# Altium project SMALL_BCMV1.0.PrjPcb (part 1 of 3)
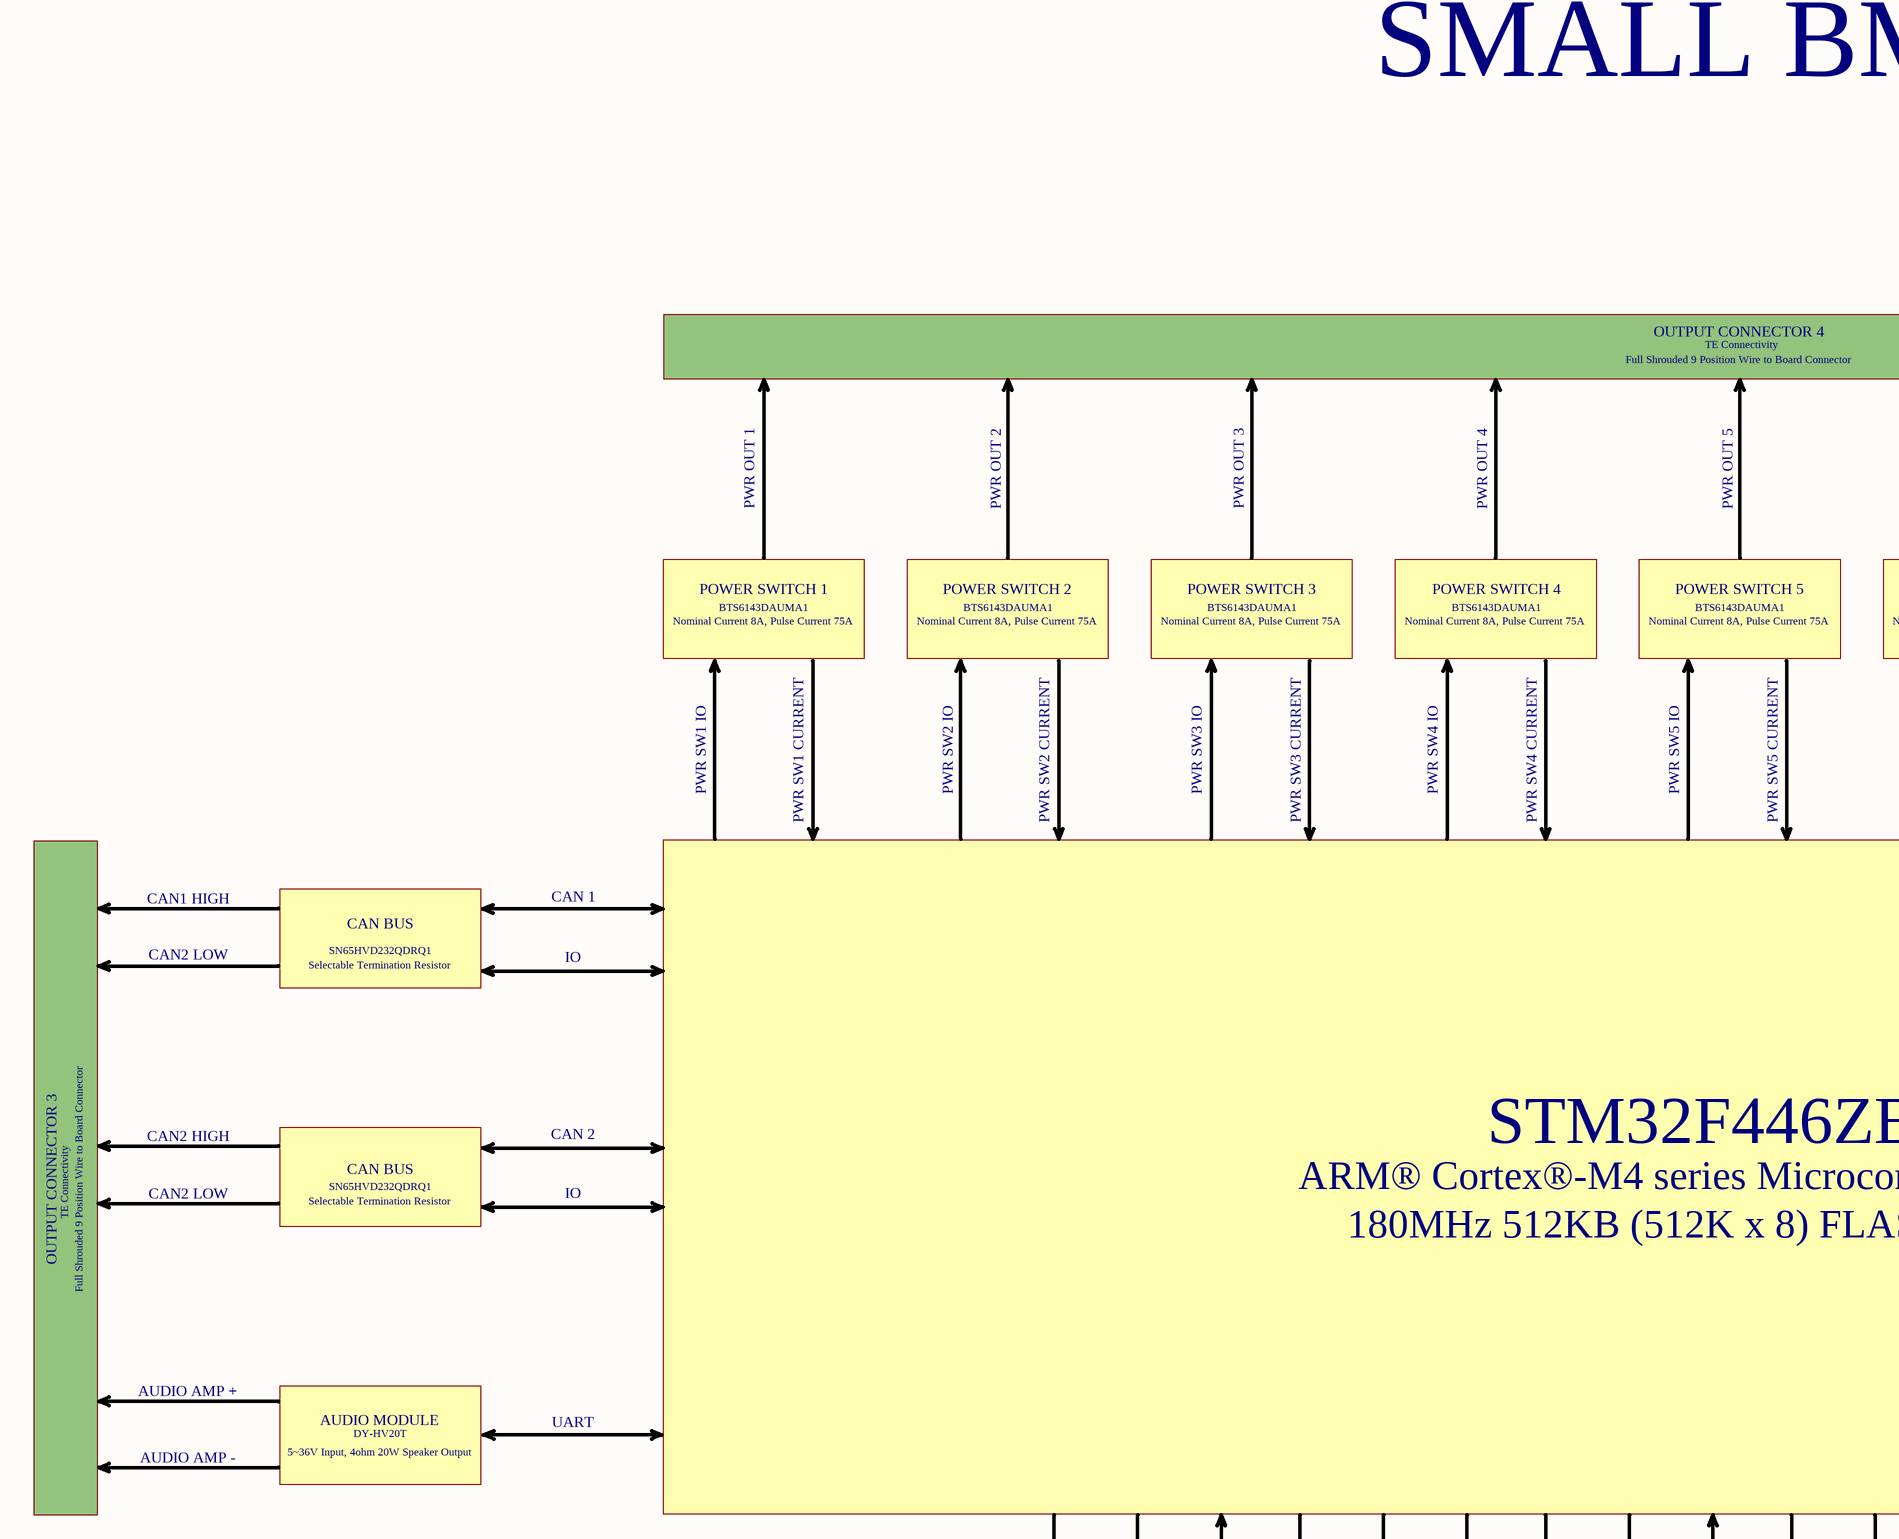
[diagram p0: BCM_Block_diagram.SchDoc, top left]
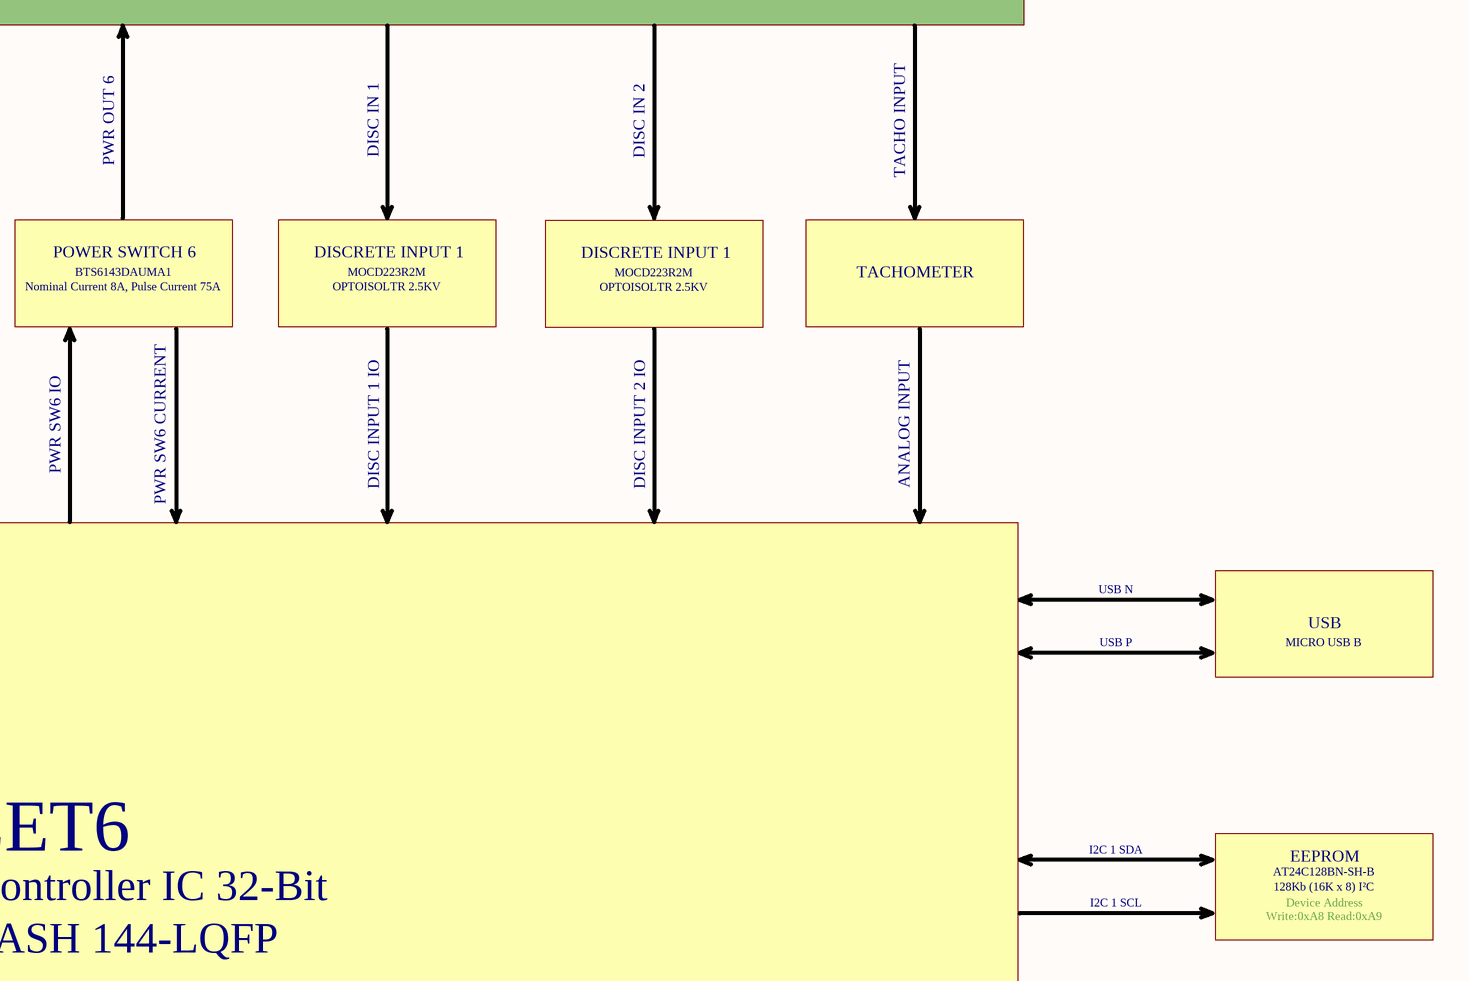
[diagram p1: BCM_Block_diagram.SchDoc, top right]
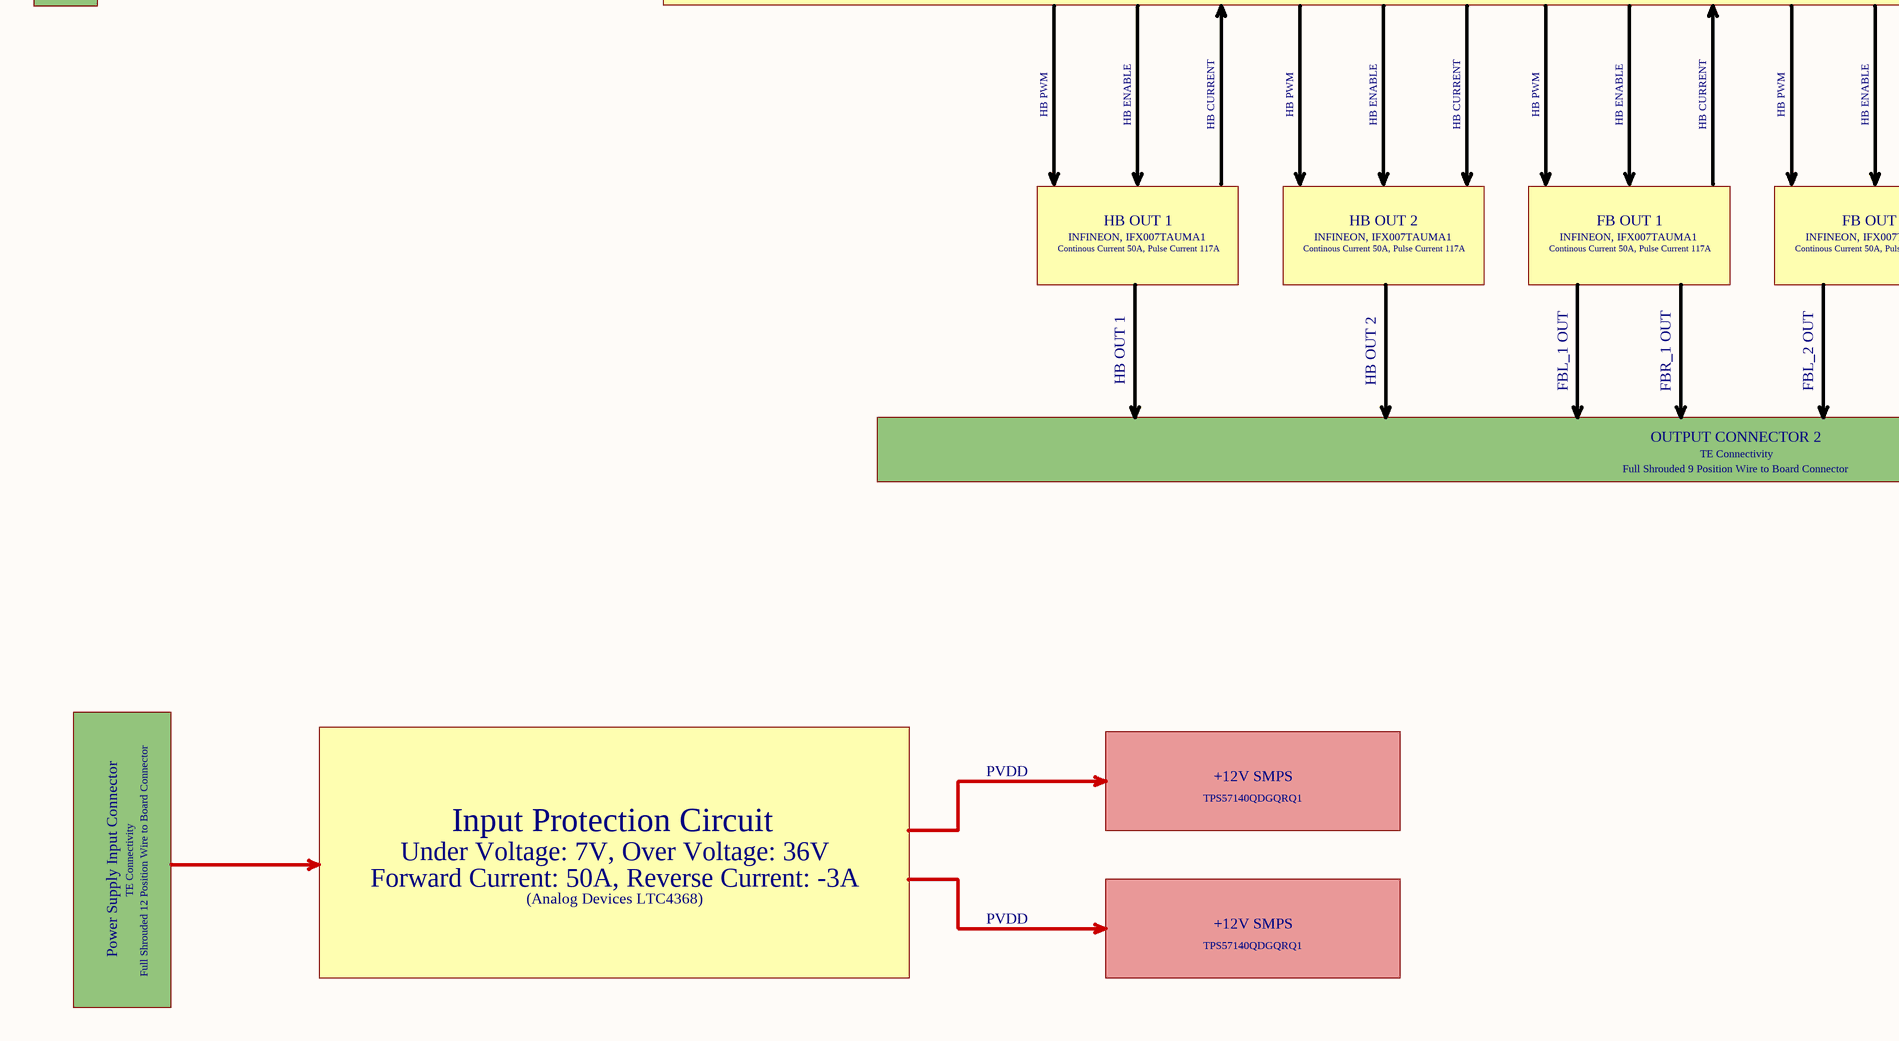
[diagram p2: BCM_Block_diagram.SchDoc, bottom left]
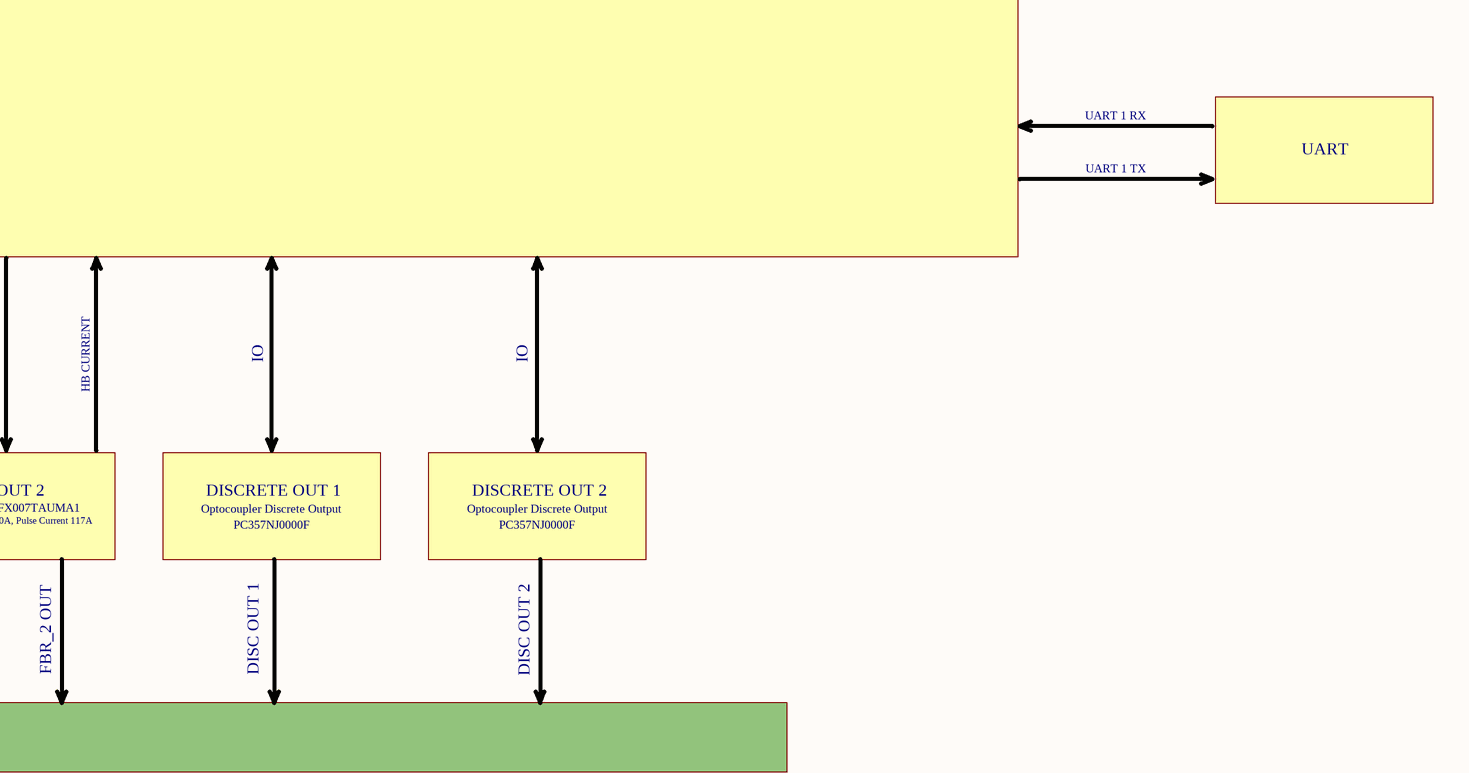
[diagram p3: BCM_Block_diagram.SchDoc, bottom right]
REV: V1.0
13 sheets, 478 parts. Net scope: hierarchical (ports join the sheet entries above them; power ports are global).
Board file: SMALL_BCM.PcbDoc
Sheets:
  BCM_Block_diagram.SchDoc
  SMALL_BCM.SchDoc
    U_F_BRIDGE1 = F_BRIDGE.SchDoc
    U_F_BRIDGE2 = F_BRIDGE.SchDoc
    U_H_BRIDGE1 = H_BRIDGE.SchDoc
    U_H_BRIDGE2 = H_BRIDGE.SchDoc
    U_HS_SW1 = HS_SW.SchDoc
    U_HS_SW2 = HS_SW.SchDoc
    U_HS_SW3 = HS_SW.SchDoc
    U_HS_SW4 = HS_SW.SchDoc
    U_HS_SW5 = HS_SW.SchDoc
    U_HS_SW6 = HS_SW.SchDoc
    U_USB = USB.SchDoc
    U_INPUT_PROTECTION = INPUT_PROTECTION.SchDoc
    U_Voltage_conversion = Voltage_conversion.SchDoc
    U_Controller = Controller.SchDoc
    U_DISCRETE_INPUT = DISCRETE_INPUT.SchDoc
    U_ANALOG_MUX = ANALOG_MUX.SchDoc
    U_DISCRETE_OUT1 = DISCRETE_OUT.SchDoc
    U_DISCRETE_OUT2 = DISCRETE_OUT.SchDoc
    U_CAN = CAN.SchDoc

## Sheet BCM_Block_diagram.SchDoc
size A1; SheetNumber: 1; SheetTotal: 13

### Notes on the sheet
- SMALL BMC V1.0
- OUTPUT CONNECTOR 4
- Full Shrouded 9 Position Wire to Board Connector
- TE Connectivity
- PWR OUT 1
- PWR OUT 2
- PWR OUT 3
- PWR OUT 4
- PWR OUT 5
- PWR OUT 6
- DISC IN 1
- DISC IN 2
- TACHO INPUT
- POWER SWITCH 1
- POWER SWITCH 2
- POWER SWITCH 3
- POWER SWITCH 4
- POWER SWITCH 5
- POWER SWITCH 6
- DISCRETE INPUT 1
- Nominal Current 8A, Pulse Current 75A
- BTS6143DAUMA1
- OPTOISOLTR 2.5KV
- MOCD223R2M
- TACHOMETER
- PWR SW1 IO
- PWR SW1 CURRENT
- PWR SW2 IO
- PWR SW2 CURRENT
- PWR SW3 IO
- PWR SW3 CURRENT
- PWR SW4 IO
- PWR SW4 CURRENT
- PWR SW5 IO
- PWR SW5 CURRENT
- PWR SW6 IO
- PWR SW6 CURRENT
- DISC INPUT 1 IO
- DISC INPUT 2 IO
- ANALOG INPUT
- CAN1 HIGH
- CAN 1
- USB N
- CAN2 LOW
- Selectable Termination Resistor
- SN65HVD232QDRQ1
- CAN BUS
- IO
- USB P
- MICRO USB B
- USB
- CAN2 HIGH
- CAN 2
- STM32F446ZET6
- I2C 1 SDA
- EEPROM
- ARM® Cortex®-M4 series Microcontroller IC 32-Bit
- I2C 1 SCL
- Write:0xA8 Read:0xA9
- AT24C128BN-SH-B
- 128Kb (16K x 8) I²C
- Device Address
- OUTPUT CONNECTOR 3
- 180MHz 512KB (512K x 8) FLASH 144-LQFP
- AUDIO AMP +
- UART 1 RX
- AUDIO AMP -
- 5~36V Input, 4ohm 20W Speaker Output
- AUDIO MODULE
- DY-HV20T
- UART
- UART 1 TX
- HB PWM
- HB ENABLE
- HB CURRENT
- Continous Current 50A, Pulse Current 117A
- INFINEON, IFX007TAUMA1
- HB OUT 1
- HB OUT 2
- FB OUT 1
- FB OUT 2
- Optocoupler Discrete Output
- DISCRETE OUT 1
- PC357NJ0000F
- DISCRETE OUT 2
- FBL_1 OUT
- FBR_1 OUT
- FBL_2 OUT
- FBR_2 OUT
- DISC OUT 1
- DISC OUT 2
- OUTPUT CONNECTOR 2
- PVDD
- TPS57140QDGQRQ1
- +12V SMPS
- Forward Current: 50A, Reverse Current: -3A
- Under Voltage: 7V, Over Voltage: 36V
- Input Protection Circuit
- Power Supply Input Connector
- (Analog Devices LTC4368)
- Full Shrouded 12 Position Wire to Board Connector
- THIS DOCUMENT AND THE DATA DISCLOSED HEREIN OR
- HEREWITH IS THE PROPERTY OF ALTIUM LIMITED AND MAY
- DWG NO:
- REVISION
- REV:
- DESCRIPTION
- DATE
- APPROVED
- BE FREELY DISTRIBUTED IN WHOLE. NO RIGHTS ARE
- RESERVED OR EXPRESS OR IMPLIED WARANTEE GIVEN.
- ENG:
- APPROVALS
- PROJECT
- DSN:
- CHK:
- REFERENCE DOCUMENTS
- PROJECT REVISION:
- TITLE
- DOCUMENT REVISION:
- DESIGN ITEM:
- BOM:
- FAB DWG:
- PCB DWG:
- ASSY DWG:
- SCALE:
- A3
- SIZE
- CAGE CODE
- FILE NAME
- DWG NO.
- SHEET
- OF
- REV

## Sheet SMALL_BCM.SchDoc
size A2; SheetNumber: 2; SheetTotal: 13
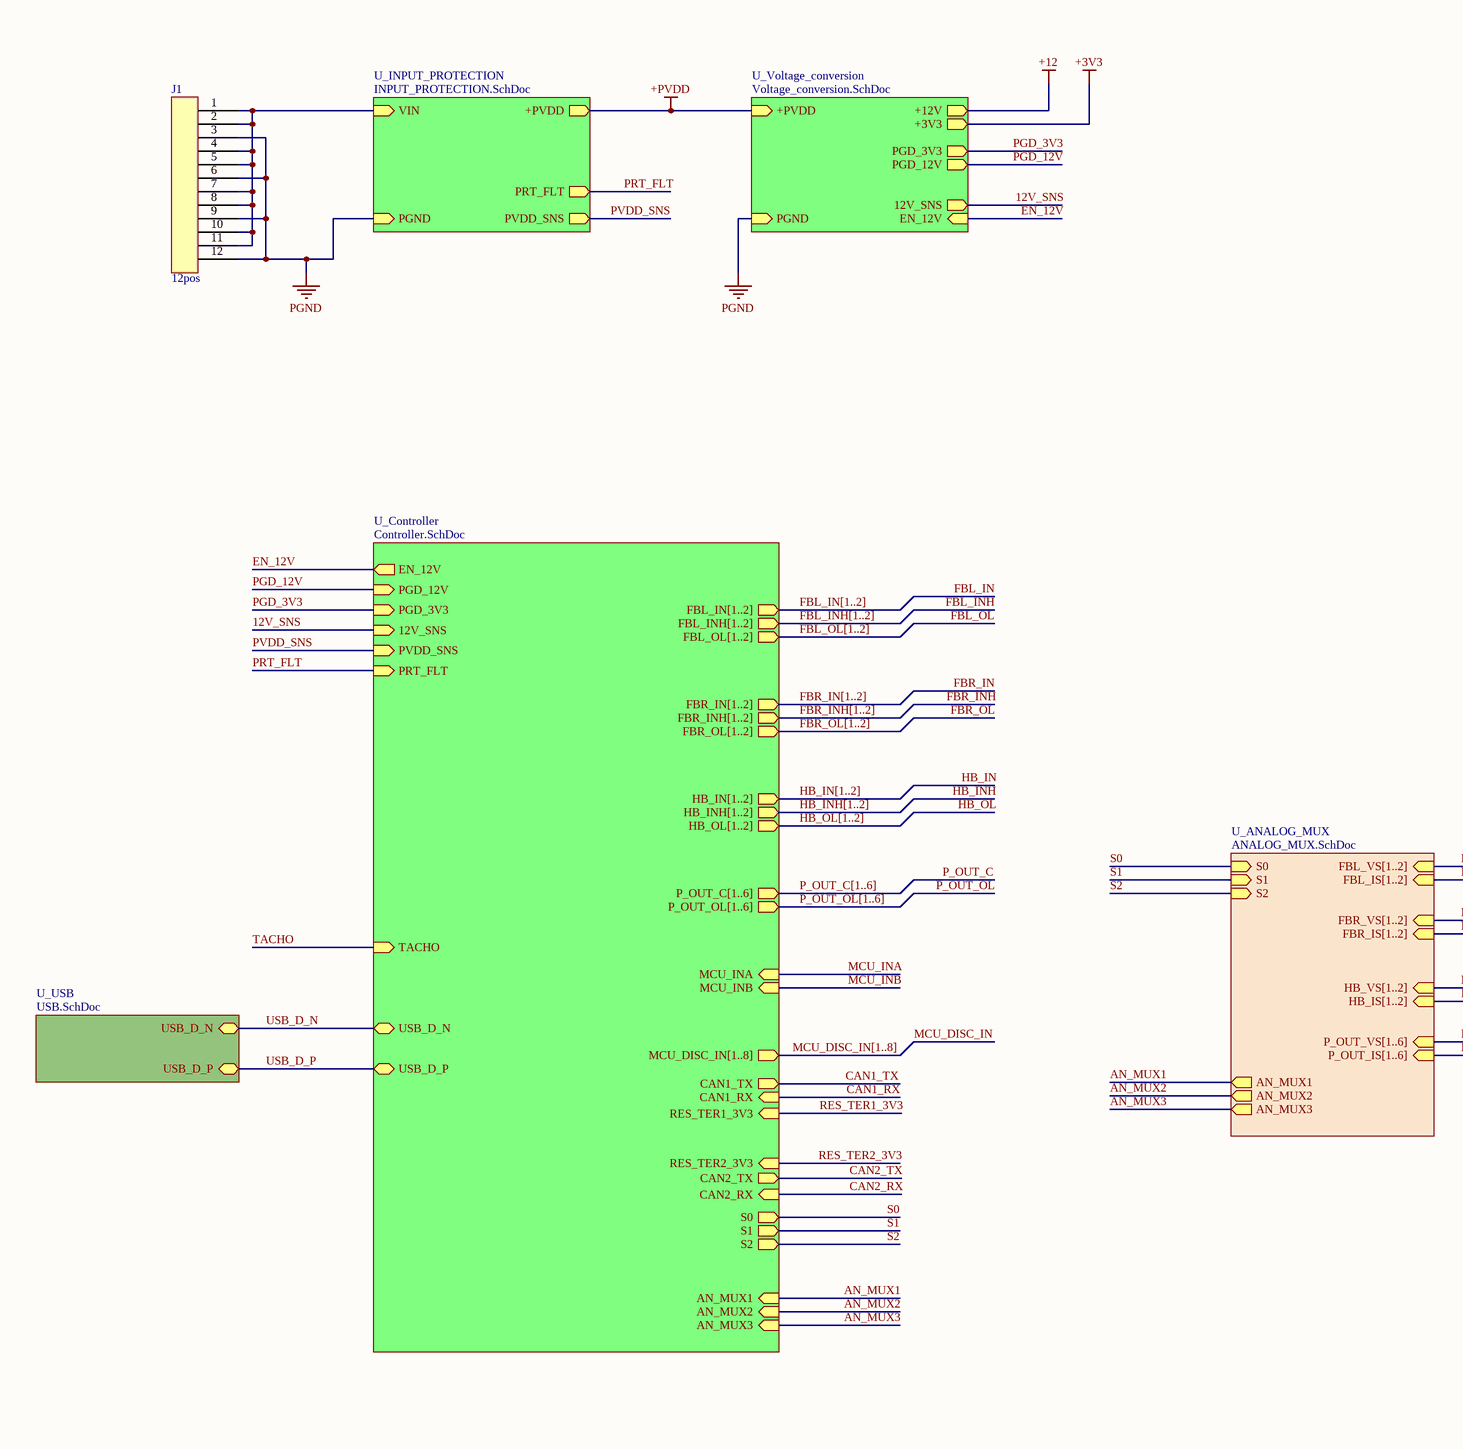
[diagram p4: SMALL_BCM.SchDoc, left]
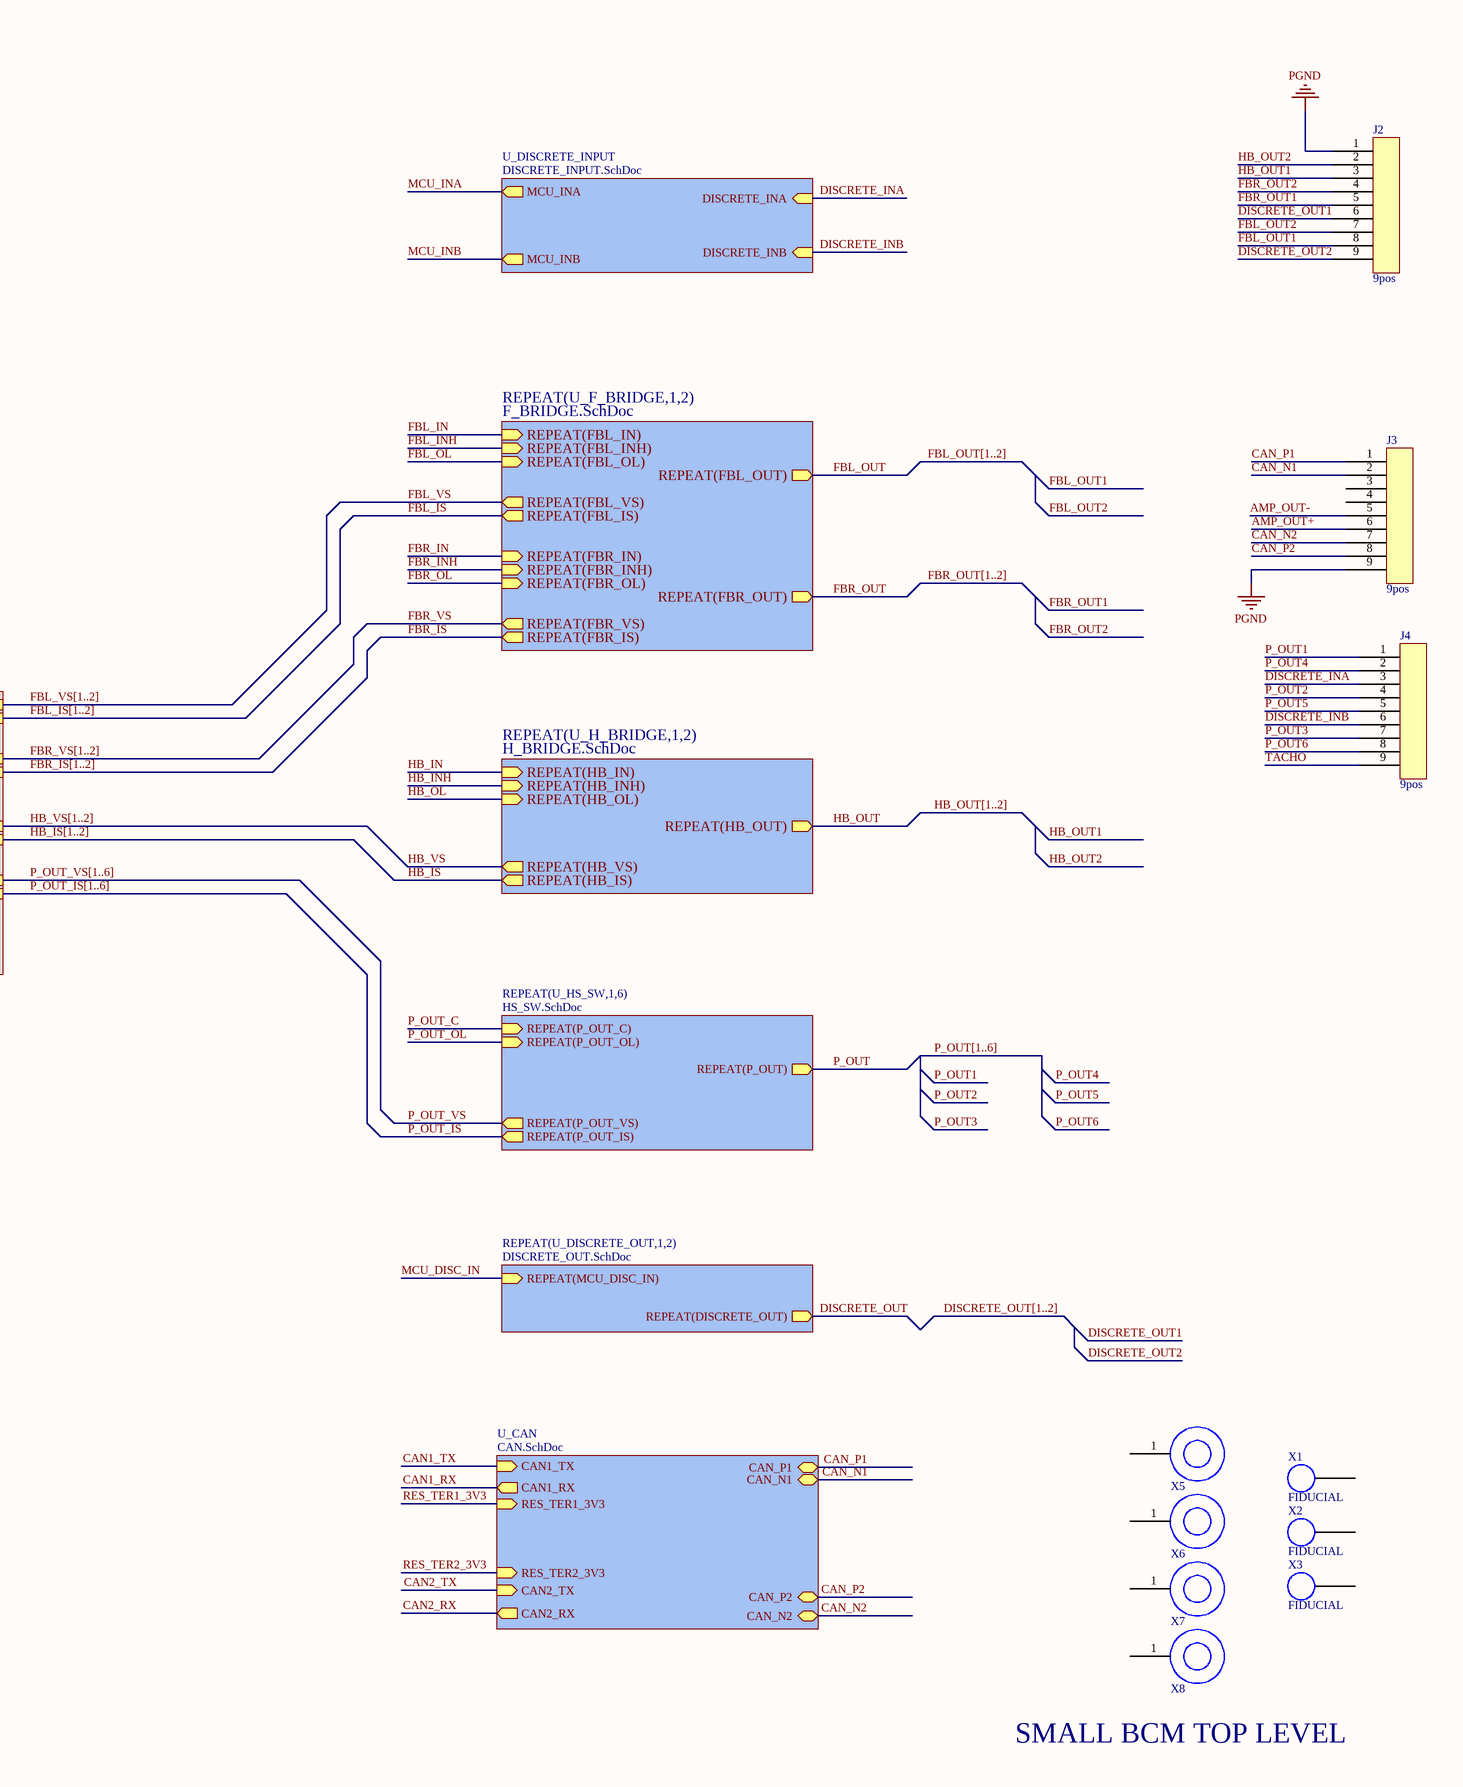
[diagram p5: SMALL_BCM.SchDoc, right]

### Parts
J1  12pos  [9-966140-3]
J2  9pos  [9-966140-4]
J3  9pos  [9-966140-4]
J4  9pos  [9-966140-4]
X1  FIDUCIAL  [FIDUCIAL]  (no BOM)
X2  FIDUCIAL  [FIDUCIAL]  (no BOM)
X3  FIDUCIAL  [FIDUCIAL]  (no BOM)
X5  M3  [FIXING_M3]  (value not drawn)  (no BOM)
X6  M3  [FIXING_M3]  (value not drawn)  (no BOM)
X7  M3  [FIXING_M3]  (value not drawn)  (no BOM)
X8  M3  [FIXING_M3]  (value not drawn)  (no BOM)

### Sub-sheets
REPEAT(U_DISCRETE_OUT,1,2) = DISCRETE_OUT.SchDoc: REPEAT(MCU_DISC_IN) (in), REPEAT(DISCRETE_OUT) (out)
REPEAT(U_F_BRIDGE,1,2) = F_BRIDGE.SchDoc: REPEAT(FBL_IN) (in), REPEAT(FBL_INH) (in), REPEAT(FBL_OL) (in), REPEAT(FBL_OUT) (out), REPEAT(FBL_VS) (out), REPEAT(FBL_IS) (out), REPEAT(FBR_IN) (in), REPEAT(FBR_INH) (in), REPEAT(FBR_OL) (in), REPEAT(FBR_OUT) (out), REPEAT(FBR_VS) (out), REPEAT(FBR_IS) (out)
REPEAT(U_H_BRIDGE,1,2) = H_BRIDGE.SchDoc: REPEAT(HB_IN) (in), REPEAT(HB_INH) (in), REPEAT(HB_IS) (out), REPEAT(HB_OL) (in), REPEAT(HB_OUT) (out), REPEAT(HB_VS) (out)
REPEAT(U_HS_SW,1,6) = HS_SW.SchDoc: REPEAT(P_OUT) (out), REPEAT(P_OUT_VS) (out), REPEAT(P_OUT_IS) (out), REPEAT(P_OUT_OL) (in), REPEAT(P_OUT_C) (in)
U_ANALOG_MUX = ANALOG_MUX.SchDoc: AN_MUX1 (out), AN_MUX2 (out), AN_MUX3 (out), S0 (in), S1 (in), S2 (in), FBR_VS[1..2] (in), FBL_VS[1..2] (in), P_OUT_VS[1..6] (in), P_OUT_IS[1..6] (in), HB_IS[1..2] (in), HB_VS[1..2] (in), FBL_IS[1..2] (in), FBR_IS[1..2] (in)
U_CAN = CAN.SchDoc: CAN_P1 (bidir), CAN_N1 (bidir), CAN1_TX (in), CAN1_RX (out), CAN_P2 (bidir), CAN_N2 (bidir), CAN2_TX (in), CAN2_RX (out), RES_TER1_3V3 (in), RES_TER2_3V3 (in)
U_Controller = Controller.SchDoc: CAN1_RX (in), CAN1_TX (out), USB_D_N (bidir), USB_D_P (bidir), HB_INH[1..2] (out), MCU_DISC_IN[1..8] (out), FBR_OL[1..2] (out), FBL_IN[1..2] (out), HB_IN[1..2] (out), 12V_SNS (in), FBL_INH[1..2] (out), HB_OL[1..2] (out), P_OUT_C[1..6] (out), MCU_INB (in), P_OUT_OL[1..6] (out), PGD_12V (in), FBL_OL[1..2] (out), MCU_INA (in), PGD_3V3 (in), FBR_INH[1..2] (out), EN_12V (out), FBR_IN[1..2] (out), S1 (out), S0 (out), S2 (out), AN_MUX3 (in), AN_MUX2 (in), AN_MUX1 (in), PVDD_SNS (in), PRT_FLT (in), TACHO (in), CAN2_RX (in), CAN2_TX (out), RES_TER2_3V3 (in), RES_TER1_3V3 (in)
U_DISCRETE_INPUT = DISCRETE_INPUT.SchDoc: MCU_INB (out), MCU_INA (out), DISCRETE_INA (in), DISCRETE_INB (in)
U_INPUT_PROTECTION = INPUT_PROTECTION.SchDoc: VIN (in), PGND (in), +PVDD (out), PRT_FLT (out), PVDD_SNS (out)
U_USB = USB.SchDoc: USB_D_N (bidir), USB_D_P (bidir)
U_Voltage_conversion = Voltage_conversion.SchDoc: +PVDD (in), PGND (in), +12V (out), PGD_12V (out), +3V3 (out), PGD_3V3 (out), 12V_SNS (out), EN_12V (in)

### Nets
+PVDD: sheet U_INPUT_PROTECTION/+PVDD, sheet U_Voltage_conversion/+PVDD
PGND: J1.3 J1.6 J1.9 J1.12 J2.1 J3.9 ; sheet U_INPUT_PROTECTION/PGND, sheet U_Voltage_conversion/PGND
VIN: J1.1 J1.2 J1.4 J1.5 J1.7 J1.8 J1.10 J1.11 ; sheet U_INPUT_PROTECTION/VIN
12V_SNS: sheet U_Voltage_conversion/12V_SNS, sheet U_Controller/12V_SNS
AMP_OUT+: J3.6
AMP_OUT-: J3.5
AN_MUX1: sheet U_Controller/AN_MUX1, sheet U_ANALOG_MUX/AN_MUX1
AN_MUX2: sheet U_Controller/AN_MUX2, sheet U_ANALOG_MUX/AN_MUX2
AN_MUX3: sheet U_Controller/AN_MUX3, sheet U_ANALOG_MUX/AN_MUX3
CAN1_RX: sheet U_Controller/CAN1_RX, sheet U_CAN/CAN1_RX
CAN1_TX: sheet U_Controller/CAN1_TX, sheet U_CAN/CAN1_TX
CAN2_RX: sheet U_Controller/CAN2_RX, sheet U_CAN/CAN2_RX
CAN2_TX: sheet U_Controller/CAN2_TX, sheet U_CAN/CAN2_TX
CAN_N1: J3.2 ; sheet U_CAN/CAN_N1  [project net CAN1_N]
CAN_N2: J3.7 ; sheet U_CAN/CAN_N2  [project net CAN2_N]
CAN_P1: J3.1 ; sheet U_CAN/CAN_P1  [project net CAN1_P]
CAN_P2: J3.8 ; sheet U_CAN/CAN_P2  [project net CAN2_P]
DISCRETE_INA: J4.3 ; sheet U_DISCRETE_INPUT/DISCRETE_INA
DISCRETE_INB: J4.6 ; sheet U_DISCRETE_INPUT/DISCRETE_INB
DISCRETE_OUT: sheet REPEAT(U_DISCRETE_OUT,1,2)/REPEAT(DISCRETE_OUT)
DISCRETE_OUT1: J2.6  [project net DISCRETE_OUT]
DISCRETE_OUT2: J2.9  [project net DISCRETE_OUT]
EN_12V: sheet U_Voltage_conversion/EN_12V, sheet U_Controller/EN_12V
FBL_IN: sheet REPEAT(U_F_BRIDGE,1,2)/REPEAT(FBL_IN)
FBL_INH: sheet REPEAT(U_F_BRIDGE,1,2)/REPEAT(FBL_INH)
FBL_IS: sheet REPEAT(U_F_BRIDGE,1,2)/REPEAT(FBL_IS)
FBL_OL: sheet REPEAT(U_F_BRIDGE,1,2)/REPEAT(FBL_OL)
FBL_OUT: sheet REPEAT(U_F_BRIDGE,1,2)/REPEAT(FBL_OUT)
FBL_OUT1: J2.8
FBL_OUT2: J2.7
FBL_VS: sheet REPEAT(U_F_BRIDGE,1,2)/REPEAT(FBL_VS)
FBR_IN: sheet REPEAT(U_F_BRIDGE,1,2)/REPEAT(FBR_IN)
FBR_INH: sheet REPEAT(U_F_BRIDGE,1,2)/REPEAT(FBR_INH)
FBR_IS: sheet REPEAT(U_F_BRIDGE,1,2)/REPEAT(FBR_IS)
FBR_OL: sheet REPEAT(U_F_BRIDGE,1,2)/REPEAT(FBR_OL)
FBR_OUT: sheet REPEAT(U_F_BRIDGE,1,2)/REPEAT(FBR_OUT)
FBR_OUT1: J2.5
FBR_OUT2: J2.4
FBR_VS: sheet REPEAT(U_F_BRIDGE,1,2)/REPEAT(FBR_VS)
HB_IN: sheet REPEAT(U_H_BRIDGE,1,2)/REPEAT(HB_IN)
HB_INH: sheet REPEAT(U_H_BRIDGE,1,2)/REPEAT(HB_INH)
HB_IS: sheet REPEAT(U_H_BRIDGE,1,2)/REPEAT(HB_IS)
HB_OL: sheet REPEAT(U_H_BRIDGE,1,2)/REPEAT(HB_OL)
HB_OUT: sheet REPEAT(U_H_BRIDGE,1,2)/REPEAT(HB_OUT)
HB_OUT1: J2.3
HB_OUT2: J2.2
HB_VS: sheet REPEAT(U_H_BRIDGE,1,2)/REPEAT(HB_VS)
MCU_DISC_IN: sheet REPEAT(U_DISCRETE_OUT,1,2)/REPEAT(MCU_DISC_IN)
MCU_INA: sheet U_Controller/MCU_INA, sheet U_DISCRETE_INPUT/MCU_INA
MCU_INB: sheet U_Controller/MCU_INB, sheet U_DISCRETE_INPUT/MCU_INB
P_OUT: sheet REPEAT(U_HS_SW,1,6)/REPEAT(P_OUT)
P_OUT1: J4.1
P_OUT2: J4.4
P_OUT3: J4.7
P_OUT4: J4.2
P_OUT5: J4.5
P_OUT6: J4.8
P_OUT_C: sheet REPEAT(U_HS_SW,1,6)/REPEAT(P_OUT_C)
P_OUT_IS: sheet REPEAT(U_HS_SW,1,6)/REPEAT(P_OUT_IS)
P_OUT_OL: sheet REPEAT(U_HS_SW,1,6)/REPEAT(P_OUT_OL)
P_OUT_VS: sheet REPEAT(U_HS_SW,1,6)/REPEAT(P_OUT_VS)
PGD_3V3: sheet U_Voltage_conversion/PGD_3V3, sheet U_Controller/PGD_3V3
PGD_12V: sheet U_Voltage_conversion/PGD_12V, sheet U_Controller/PGD_12V  [project net PDG_12V]
PRT_FLT: sheet U_INPUT_PROTECTION/PRT_FLT, sheet U_Controller/PRT_FLT
PVDD_SNS: sheet U_INPUT_PROTECTION/PVDD_SNS, sheet U_Controller/PVDD_SNS
RES_TER1_3V3: sheet U_Controller/RES_TER1_3V3, sheet U_CAN/RES_TER1_3V3
RES_TER2_3V3: sheet U_Controller/RES_TER2_3V3, sheet U_CAN/RES_TER2_3V3
S0: sheet U_Controller/S0, sheet U_ANALOG_MUX/S0
S1: sheet U_Controller/S1, sheet U_ANALOG_MUX/S1
S2: sheet U_Controller/S2, sheet U_ANALOG_MUX/S2
TACHO: J4.9 ; sheet U_Controller/TACHO
USB_D_N: sheet U_USB/USB_D_N, sheet U_Controller/USB_D_N
USB_D_P: sheet U_USB/USB_D_P, sheet U_Controller/USB_D_P

Not connected (* = marked no-connect by the designer): J3 3 4; X1 1; X2 1; X3 1; X5 1; X6 1; X7 1; X8 1

### Buses and harness runs
bus DISCRETE_OUT[1..2]
bus FBL_IN[1..2] = sheet U_Controller/FBL_IN[1..2]
bus FBL_INH[1..2] = sheet U_Controller/FBL_INH[1..2]
bus FBL_IS[1..2] = sheet U_ANALOG_MUX/FBL_IS[1..2]
bus FBL_OL[1..2] = sheet U_Controller/FBL_OL[1..2]
bus FBL_OUT[1..2]
bus FBL_VS[1..2] = sheet U_ANALOG_MUX/FBL_VS[1..2]
bus FBR_IN[1..2] = sheet U_Controller/FBR_IN[1..2]
bus FBR_INH[1..2] = sheet U_Controller/FBR_INH[1..2]
bus FBR_IS[1..2] = sheet U_ANALOG_MUX/FBR_IS[1..2]
bus FBR_OL[1..2] = sheet U_Controller/FBR_OL[1..2]
bus FBR_OUT[1..2]
bus FBR_VS[1..2] = sheet U_ANALOG_MUX/FBR_VS[1..2]
bus HB_IN[1..2] = sheet U_Controller/HB_IN[1..2]
bus HB_INH[1..2] = sheet U_Controller/HB_INH[1..2]
bus HB_IS[1..2] = sheet U_ANALOG_MUX/HB_IS[1..2]
bus HB_OL[1..2] = sheet U_Controller/HB_OL[1..2]
bus HB_OUT[1..2]
bus HB_VS[1..2] = sheet U_ANALOG_MUX/HB_VS[1..2]
bus MCU_DISC_IN[1..8] = sheet U_Controller/MCU_DISC_IN[1..8]
bus P_OUT[1..6]
bus P_OUT_C[1..6] = sheet U_Controller/P_OUT_C[1..6]
bus P_OUT_IS[1..6] = sheet U_ANALOG_MUX/P_OUT_IS[1..6]
bus P_OUT_OL[1..6] = sheet U_Controller/P_OUT_OL[1..6]
bus P_OUT_VS[1..6] = sheet U_ANALOG_MUX/P_OUT_VS[1..6]

### Notes on the sheet
- SMALL BCM TOP LEVEL

### Library data of the parts
J1 = 3x4_9-966140-3: CONN HEADER R/A 12POS 5MM; Order Code: DIGI : A126711-ND; P/N: 9-966140-3; Value: 12pos
J2-J4 = 3x4_9-966140-4: CONN HEADER R/A 9POS 5MM; Order Code: DIGI : A122202-ND; P/N: 9-966140-4; Value: 9pos
X1-X3 = FIDUCIAL: FIDUCIAL 1mm
X5-X8 = FIXING_M3: FIXING HOLE M3; Value: M3

## Sheet F_BRIDGE.SchDoc
size A4; SheetNumber: 5; SheetTotal: 13
Used 2 times, as channels U_F_BRIDGE1, U_F_BRIDGE2. Parts and nets are listed once, with the designators drawn on the sheet.
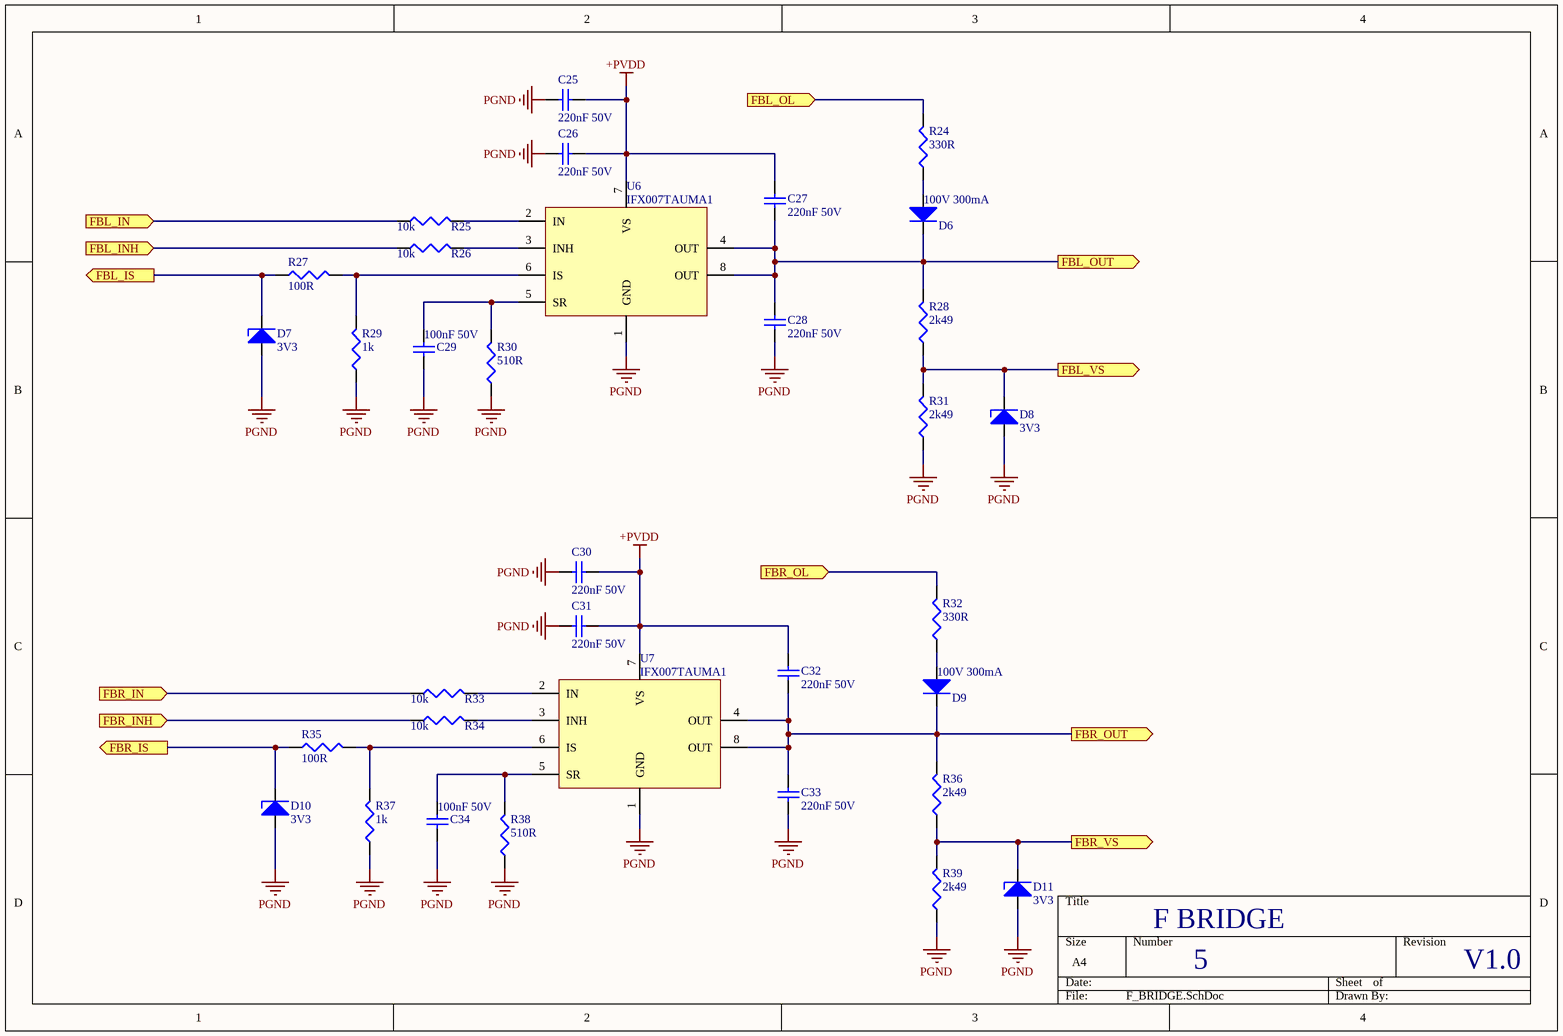
[diagram p6: F_BRIDGE.SchDoc]

### Parts
C25  220nF 50V  [CAP1206]
C26  220nF 50V  [CAP1206]
C27  220nF 50V  [CAP1206]
C28  220nF 50V  [CAP1206]
C29  100nF 50V  [CAP0603]
C30  220nF 50V  [CAP1206]
C31  220nF 50V  [CAP1206]
C32  220nF 50V  [CAP1206]
C33  220nF 50V  [CAP1206]
C34  100nF 50V  [CAP0603]
D6  100V 300mA  [SOD123_1N4148W-7-F]
D7  3V3  [SOD323]
D8  3V3  [SOD323]
D9  100V 300mA  [SOD123_1N4148W-7-F]
D10  3V3  [SOD323]
D11  3V3  [SOD323]
R24  330R  [RES0603]
R25  10k  [RES0603]
R26  10k  [RES0603]
R27  100R  [RES0603]
R28  2k49  [RES0603]
R29  1k  [RES0603]
R30  510R  [RES0603]
R31  2k49  [RES0603]
R32  330R  [RES0603]
R33  10k  [RES0603]
R34  10k  [RES0603]
R35  100R  [RES0603]
R36  2k49  [RES0603]
R37  1k  [RES0603]
R38  510R  [RES0603]
R39  2k49  [RES0603]
U6  P/N: IFX007TAUMA1  [TO-263-8]  (hidden comment: 55A)
U7  P/N: IFX007TAUMA1  [TO-263-8]  (hidden comment: 55A)

### Ports
FBL_IN (in), FBL_INH (in), FBL_IS (out), FBL_OL (in), FBL_OUT (out), FBL_VS (out), FBR_IN (in), FBR_INH (in), FBR_IS (out), FBR_OL (in), FBR_OUT (out), FBR_VS (out)

### Nets
+PVDD: C25.2 C26.2 C27.1 C30.2 C31.2 C32.1 U6.7(VS) U7.7(VS)
PGND: C25.1 C26.1 C28.2 C29.1 C30.1 C31.1 C33.2 C34.1 D7.2(A) D8.2(A) D10.2(A) D11.2(A) R29.1 R30.1 R31.1 R37.1 R38.1 R39.1 U6.1(GND) U7.1(GND)
FBL_IN: R25.1 ; port FBL_IN
FBL_INH: R26.1 ; port FBL_INH
FBL_IS: D7.1(K) R27.1 ; port FBL_IS
FBL_OL: R24.2 ; port FBL_OL
FBL_OUT: C27.2 C28.1 D6.2(K) R28.2 U6.4(OUT) U6.8(OUT) ; port FBL_OUT
FBL_VS: D8.1(K) R28.1 R31.2 ; port FBL_VS
FBR_IN: R33.1 ; port FBR_IN
FBR_INH: R34.1 ; port FBR_INH
FBR_IS: D10.1(K) R35.1 ; port FBR_IS
FBR_OL: R32.2 ; port FBR_OL
FBR_OUT: C32.2 C33.1 D9.2(K) R36.2 U7.4(OUT) U7.8(OUT) ; port FBR_OUT
FBR_VS: D11.1(K) R36.1 R39.2 ; port FBR_VS
NetC29_2: C29.2 R30.2 U6.5(SR)
NetC34_2: C34.2 R38.2 U7.5(SR)
NetD6_1: D6.1(A) R24.1
NetD9_1: D9.1(A) R32.1
NetR25_2: R25.2 U6.2(IN)
NetR26_2: R26.2 U6.3(INH)
NetR27_2: R27.2 R29.2 U6.6(IS)
NetR33_2: R33.2 U7.2(IN)
NetR34_2: R34.2 U7.3(INH)
NetR35_2: R35.2 R37.2 U7.6(IS)

### Channels
U_F_BRIDGE1: designators end in A; ports FBL_IN=FBL_IN1 FBL_INH=FBL_INH1 FBL_IS=FBL_IS1 FBL_OL=FBL_OL1 FBL_OUT=FBL_OUT1 FBL_VS=FBL_VS1 FBR_IN=FBR_IN1 FBR_INH=FBR_INH1 FBR_IS=FBR_IS1 FBR_OL=FBR_OL1 FBR_OUT=FBR_OUT1 FBR_VS=FBR_VS1
U_F_BRIDGE2: designators end in B; ports FBL_IN=FBL_IN2 FBL_INH=FBL_INH2 FBL_IS=FBL_IS2 FBL_OL=FBL_OL2 FBL_OUT=FBL_OUT2 FBL_VS=FBL_VS2 FBR_IN=FBR_IN2 FBR_INH=FBR_INH2 FBR_IS=FBR_IS2 FBR_OL=FBR_OL2 FBR_OUT=FBR_OUT2 FBR_VS=FBR_VS2

### Notes on the sheet
- F BRIDGE

### Library data of the parts
C25-C28 C30-C33 = CAP1206_220nF: CAP CER 0.22UF 50V X7R 1206; P/N: CL31B224KBFNNNE; Order Code: DIGI : CL31B224KBFNNNE; Value: 220nF
C29 C34 = CAP0603_100nF: CAP CER 0.1UF 50V X7R 0603; P/N: C0603C104K5RACTU; Order Code: DIGI : 399-5089-1-ND; Value: 100nF 50V
D6 D9 = DIODE_1N4148W-7-F: DIODE GEN PURP 100V 300MA SOD123; Order Code: DIGI : 1N4148W-FDICT-ND; P/N: 1N4148W-7-F; Value: 100V 300mA
D7 D8 D10 D11 = ZENER_3V3_MM3Z3V3T1G: DIODE ZENER 3.3V 300MW SOD323; Order Code: DIGI : MM3Z3V3T1GOSCT-ND; P/N: MM3Z3V3T1G; Value: 3V3
R24 R32 = RES0603_330R: RES 330 OHM 1% 1/10W 0603; Order Code: DIGI : RMCF0603FT330RCT-ND; P/N: RMCF0603FT330R; ART Code: ART0021648; Value: 330R
R25 R26 R33 R34 = RES0603_10k: RES SMD 10K OHM 5% 1/10W 0603; Order Code: DIGI : 311-10KGRCT-ND; P/N: RC0603JR-0710KL; ART Code: ART0020747; Value: 10k
R27 R35 = RES0603_100R: RES SMD 100R OHM 1% 1/10W 0603; Order Code: DIGI : RMCF0603FT100RCT-ND; P/N: RMCF0603FT100R; ART Code: ART0022201; Value: 100R
R28 R31 R36 R39 = RES0603_2k49: RES 2.49K OHM 1% 1/10W 0603; Order Code: DIGI : RMCF0603FT2K49CT-ND; P/N: RMCF0603FT2K49; ART Code: ART0014241; Value: 2k49
R29 R37 = RES0603_1k: RES SMD 1K OHM 1% 1/10W 0603; Order Code: DIGI : 311-1.00KHRCT-ND; P/N: RC0603FR-071KL; ART Code: ART0014240; Value: 1k
R30 R38 = RES0603_510R: RES 510R OHM 1% 1/10W 0603; Order Code: DIGI : RMCF0603FT510RCT-ND; P/N: RMCF0603FT510R; Value: 510R
U6 U7 = HB_IFX007TAUMA1: IC HALF-BRIDGE DRVR 2 CH TO263; Order Code: DIGI : IFX007TAUMA1CT-ND; Value: 55A

## Sheet H_BRIDGE.SchDoc
size A4; SheetNumber: 6; SheetTotal: 13
Used 2 times, as channels U_H_BRIDGE1, U_H_BRIDGE2. Parts and nets are listed once, with the designators drawn on the sheet.
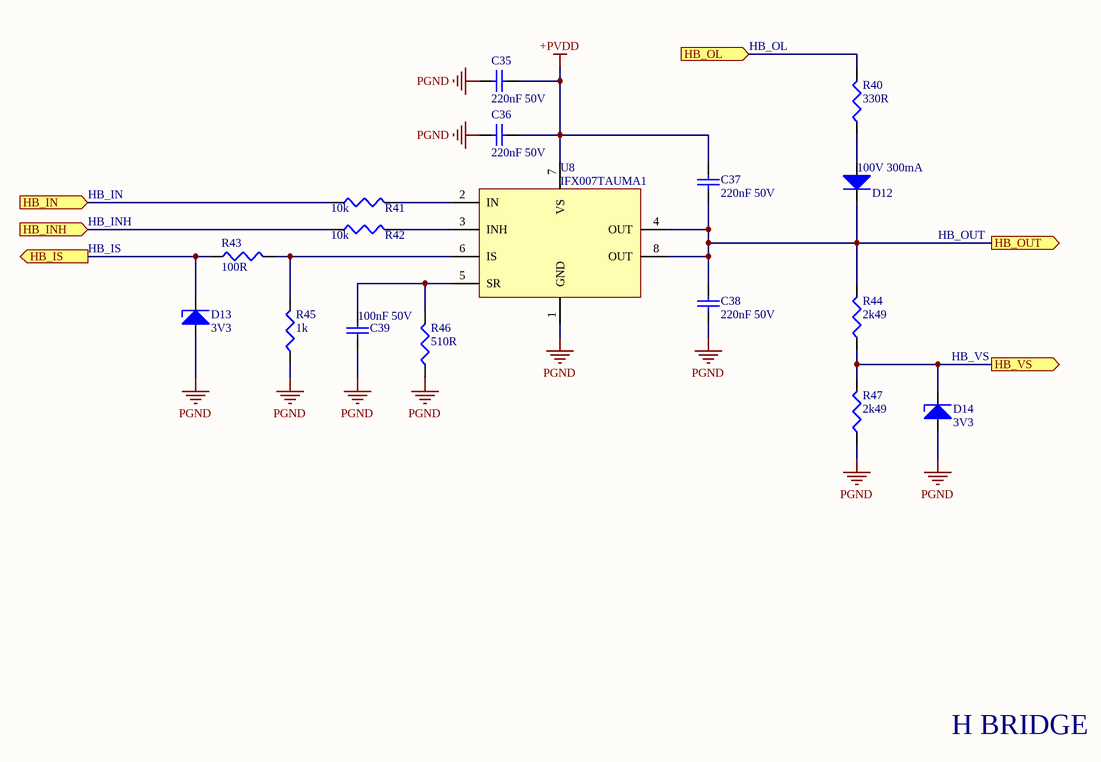
[diagram p7: H_BRIDGE.SchDoc]

### Parts
C35  220nF 50V  [CAP1206]
C36  220nF 50V  [CAP1206]
C37  220nF 50V  [CAP1206]
C38  220nF 50V  [CAP1206]
C39  100nF 50V  [CAP0603]
D12  100V 300mA  [SOD123_1N4148W-7-F]
D13  3V3  [SOD323]
D14  3V3  [SOD323]
R40  330R  [RES0603]
R41  10k  [RES0603]
R42  10k  [RES0603]
R43  100R  [RES0603]
R44  2k49  [RES0603]
R45  1k  [RES0603]
R46  510R  [RES0603]
R47  2k49  [RES0603]
U8  P/N: IFX007TAUMA1  [TO-263-8]  (hidden comment: 55A)

### Ports
HB_IN (in), HB_INH (in), HB_IS (out), HB_OL (in), HB_OUT (out), HB_VS (out)

### Nets
+PVDD: C35.2 C36.2 C37.1 U8.7(VS)
PGND: C35.1 C36.1 C38.2 C39.1 D13.2(A) D14.2(A) R45.1 R46.1 R47.1 U8.1(GND)
HB_IN: R41.1 ; port HB_IN
HB_INH: R42.1 ; port HB_INH
HB_IS: D13.1(K) R43.1 ; port HB_IS
HB_OL: R40.2 ; port HB_OL
HB_OUT: C37.2 C38.1 D12.2(K) R44.2 U8.4(OUT) U8.8(OUT) ; port HB_OUT
HB_VS: D14.1(K) R44.1 R47.2 ; port HB_VS
NetC39_2: C39.2 R46.2 U8.5(SR)
NetD12_1: D12.1(A) R40.1
NetR41_2: R41.2 U8.2(IN)
NetR42_2: R42.2 U8.3(INH)
NetR43_2: R43.2 R45.2 U8.6(IS)

### Channels
U_H_BRIDGE1: designators end in A; ports HB_IN=HB_IN1 HB_INH=HB_INH1 HB_IS=HB_IS1 HB_OL=HB_OL1 HB_OUT=HB_OUT1 HB_VS=HB_VS1
U_H_BRIDGE2: designators end in B; ports HB_IN=HB_IN2 HB_INH=HB_INH2 HB_IS=HB_IS2 HB_OL=HB_OL2 HB_OUT=HB_OUT2 HB_VS=HB_VS2

### Notes on the sheet
- HB_OL
- HB_IN
- HB_INH
- HB_IS
- HB_OUT
- (near D14) HB_VS
- H BRIDGE

### Library data of the parts
C35-C38 = CAP1206_220nF: as C25 on sheet F_BRIDGE; Value: 220nF
C39 = CAP0603_100nF: as C29 on sheet F_BRIDGE; Value: 100nF 50V
D12 = DIODE_1N4148W-7-F: as D6 on sheet F_BRIDGE; P/N: 1N4148W-7-F; Value: 100V 300mA
D13 D14 = ZENER_3V3_MM3Z3V3T1G: as D7 on sheet F_BRIDGE; P/N: MM3Z3V3T1G; Value: 3V3
R40 = RES0603_330R: as R24 on sheet F_BRIDGE; Value: 330R
R41 R42 = RES0603_10k: as R25 on sheet F_BRIDGE; Value: 10k
R43 = RES0603_100R: as R27 on sheet F_BRIDGE; Value: 100R
R44 R47 = RES0603_2k49: as R28 on sheet F_BRIDGE; Value: 2k49
R45 = RES0603_1k: as R29 on sheet F_BRIDGE; Value: 1k
R46 = RES0603_510R: as R30 on sheet F_BRIDGE; Value: 510R
U8 = HB_IFX007TAUMA1: as U6 on sheet F_BRIDGE; Value: 55A

## Sheet HS_SW.SchDoc
size A4; SheetNumber: 7; SheetTotal: 13
Used 6 times, as channels U_HS_SW1, U_HS_SW2, U_HS_SW3, U_HS_SW4, U_HS_SW5, U_HS_SW6. Parts and nets are listed once, with the designators drawn on the sheet.
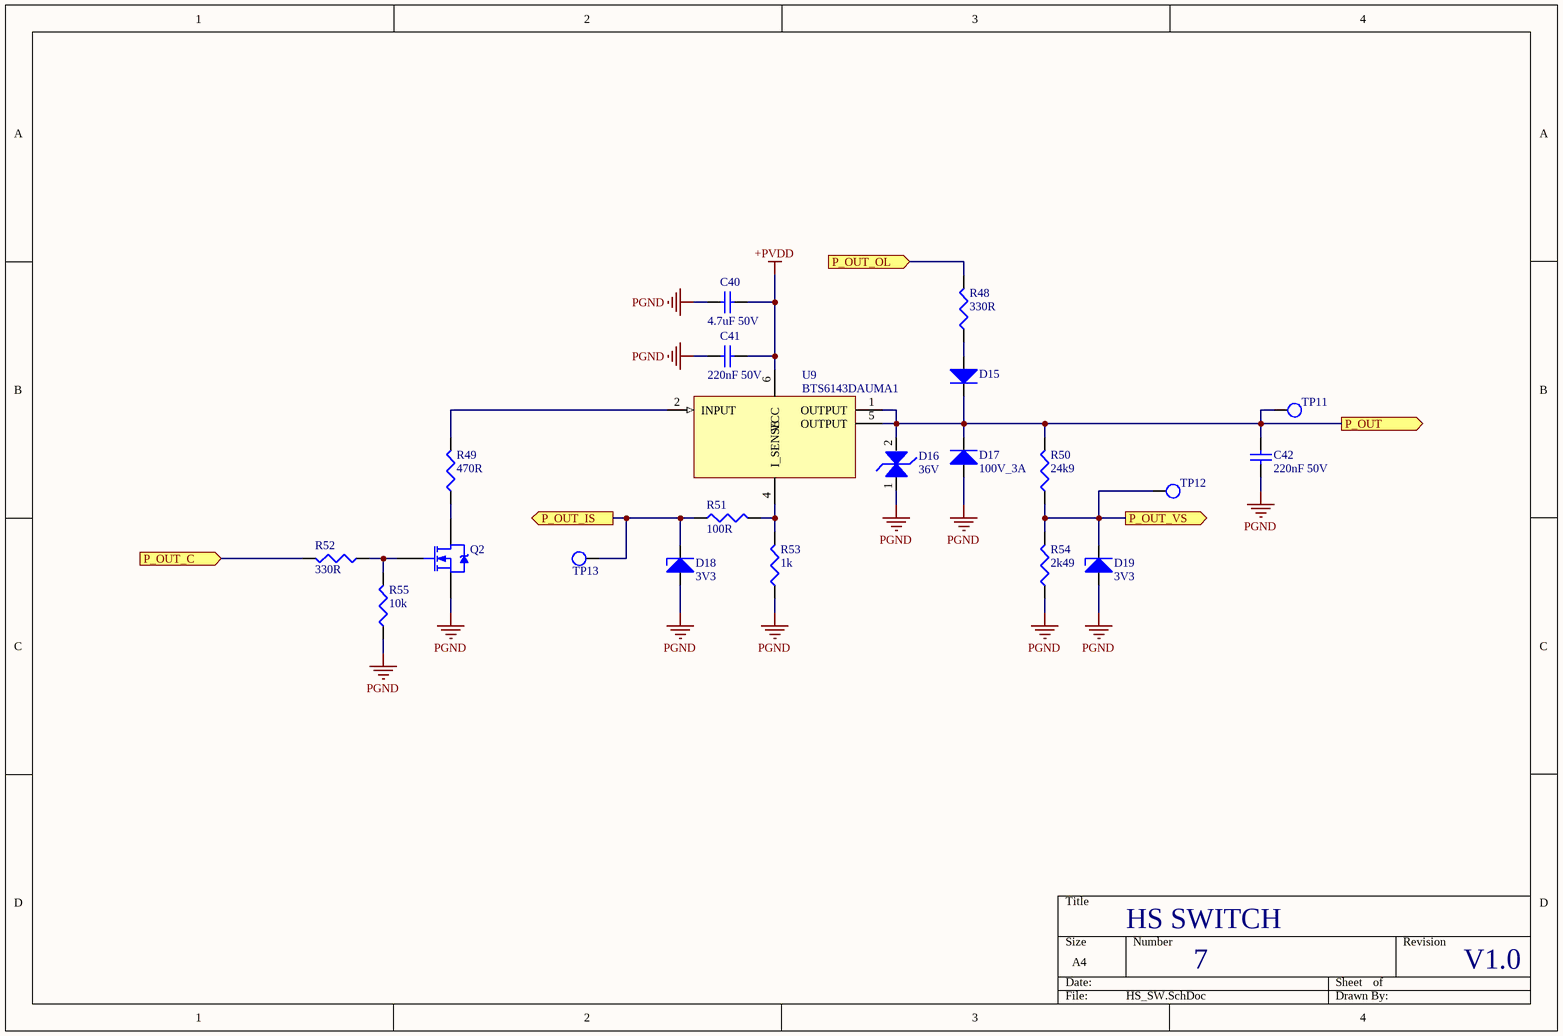
[diagram p8: HS_SW.SchDoc]

### Parts
C40  4.7uF 50V  [CAP1206]
C41  220nF 50V  [CAP1206]
C42  220nF 50V  [CAP1206]
D15  100V 300mA  [SOD123_1N4148W-7-F]  (value not drawn)
D16  36V  [DO214AA]
D17  100V_3A  [DO-221A]
D18  3V3  [SOD323]
D19  3V3  [SOD323]
Q2  60V 360mA  [SOT23_2N7002]  (value not drawn)
R48  330R  [RES0603]
R49  470R  [RES0603]
R50  24k9  [RES0603]
R51  100R  [RES0603]
R52  330R  [RES0603]
R53  1k  [RES0603]
R54  2k49  [RES0603]
R55  10k  [RES0603]
TP11  TEST_POINT  [TEST_POINT_TH]  (value not drawn)  (no BOM)
TP12  TEST_POINT  [TEST_POINT_TH]  (value not drawn)  (no BOM)
TP13  TEST_POINT  [TEST_POINT_TH]  (value not drawn)  (no BOM)
U9  P/N: BTS6143DAUMA1  [TO252-5]  (hidden comment: 33A)

### Ports
P_OUT (out), P_OUT_C (in), P_OUT_IS (out), P_OUT_OL (in), P_OUT_VS (out)

### Nets
+PVDD: C40.2 C41.1 U9.6(VCC)
PGND: C40.1 C41.2 C42.1 D16.1 D17.2(A) D18.2(A) D19.2(A) Q2.2(S) R53.1 R54.1 R55.1
P_OUT: C42.2 D15.2(K) D16.2 D17.1(K) R50.2 TP11.1 U9.1(OUTPUT) U9.5(OUTPUT) ; port P_OUT
P_OUT_C: R52.2 ; port P_OUT_C
P_OUT_IS: D18.1(K) R51.1 TP13.1 ; port P_OUT_IS
P_OUT_OL: R48.2 ; port P_OUT_OL
P_OUT_VS: D19.1(K) R50.1 R54.2 TP12.1 ; port P_OUT_VS
NetD15_1: D15.1(A) R48.1
NetQ2_1: Q2.1(G) R52.1 R55.2
NetQ2_3: Q2.3(D) R49.1
NetR49_2: R49.2 U9.2(INPUT)
NetR51_2: R51.2 R53.2 U9.4(I_SENSE)

### Channels
U_HS_SW1: designators end in A; ports P_OUT=P_OUT1 P_OUT_C=P_OUT_C1 P_OUT_IS=P_OUT_IS1 P_OUT_OL=P_OUT_OL1 P_OUT_VS=P_OUT_VS1
U_HS_SW2: designators end in B; ports P_OUT=P_OUT2 P_OUT_C=P_OUT_C2 P_OUT_IS=P_OUT_IS2 P_OUT_OL=P_OUT_OL2 P_OUT_VS=P_OUT_VS2
U_HS_SW3: designators end in C; ports P_OUT=P_OUT3 P_OUT_C=P_OUT_C3 P_OUT_IS=P_OUT_IS3 P_OUT_OL=P_OUT_OL3 P_OUT_VS=P_OUT_VS3
U_HS_SW4: designators end in D; ports P_OUT=P_OUT4 P_OUT_C=P_OUT_C4 P_OUT_IS=P_OUT_IS4 P_OUT_OL=P_OUT_OL4 P_OUT_VS=P_OUT_VS4
U_HS_SW5: designators end in E; ports P_OUT=P_OUT5 P_OUT_C=P_OUT_C5 P_OUT_IS=P_OUT_IS5 P_OUT_OL=P_OUT_OL5 P_OUT_VS=P_OUT_VS5
U_HS_SW6: designators end in F; ports P_OUT=P_OUT6 P_OUT_C=P_OUT_C6 P_OUT_IS=P_OUT_IS6 P_OUT_OL=P_OUT_OL6 P_OUT_VS=P_OUT_VS6

### Notes on the sheet
- HS SWITCH

### Library data of the parts
C40 = CAP1206_4.7uF: CAP CER 4.7UF 50V %20 X7R 1206; P/N: GRJ31CR71H475KE11L; Order Code: DIGI : 490-10944-1-ND; Value: 4.7uF 50V
C41 C42 = CAP1206_220nF: as C25 on sheet F_BRIDGE; Value: 220nF
D15 = DIODE_1N4148W-7-F: as D6 on sheet F_BRIDGE; P/N: 1N4148W-7-F; Value: 100V 300mA
D16 = SMBJ36CA-TR_TVS_BI_DIR: TVS DIODE 36V DO214AA; Order Code: DIGI : 497-12053-1-ND; P/N: SMBJ36CA-TR; Value: 36V
D17 = FRED_VS-3EYH01-M3/H_100V_3A: DIODE FRED 100V 3A DO-221AD; Value: 100V 3A; Order Code: DIGI : 112-VS-3EYH01-M3/HCT-ND; P/N: VS-3EYH01-M3/H
D18 D19 = ZENER_3V3_MM3Z3V3T1G: as D7 on sheet F_BRIDGE; P/N: MM3Z3V3T1G; Value: 3V3
Q2 = 2N7002P,215_NMOS_60V: MOSFET N-CH 60V 0.36A SOT-23; Order Code: DIGI : 1727-4692-1-ND; Value: 60V 360mA; P/N: 2N7002P,215
R48 R52 = RES0603_330R: as R24 on sheet F_BRIDGE; Value: 330R
R49 = RES0603_470R: RES SMD 470 OHM 1% 1/10W 0603; Order Code: DIGI : 311-470HRCT-ND; P/N: RC0603FR-07470RL; ART Code: ART0023387; Value: 470R
R50 = RES0603_24k9: RES SMD 24.9K OHM 1% 1/10W 0603; Order Code: DIGI : P24.9KHCT-ND; P/N: ERJ-3EKF2492V; Value: 24k9
R51 = RES0603_100R: as R27 on sheet F_BRIDGE; Value: 100R
R53 = RES0603_1k: as R29 on sheet F_BRIDGE; Value: 1k
R54 = RES0603_2k49: as R28 on sheet F_BRIDGE; Value: 2k49
R55 = RES0603_10k: as R25 on sheet F_BRIDGE; Value: 10k
U9 = PD_SW_BTS6143DAUMA1: IC HIGH SIDE PWR SWITCH DPAK-5; Order Code: DIGI : BTS6143DAUMA1CT-ND; Value: 33A

## Sheet USB.SchDoc
size A4; SheetNumber: 9; SheetTotal: 13
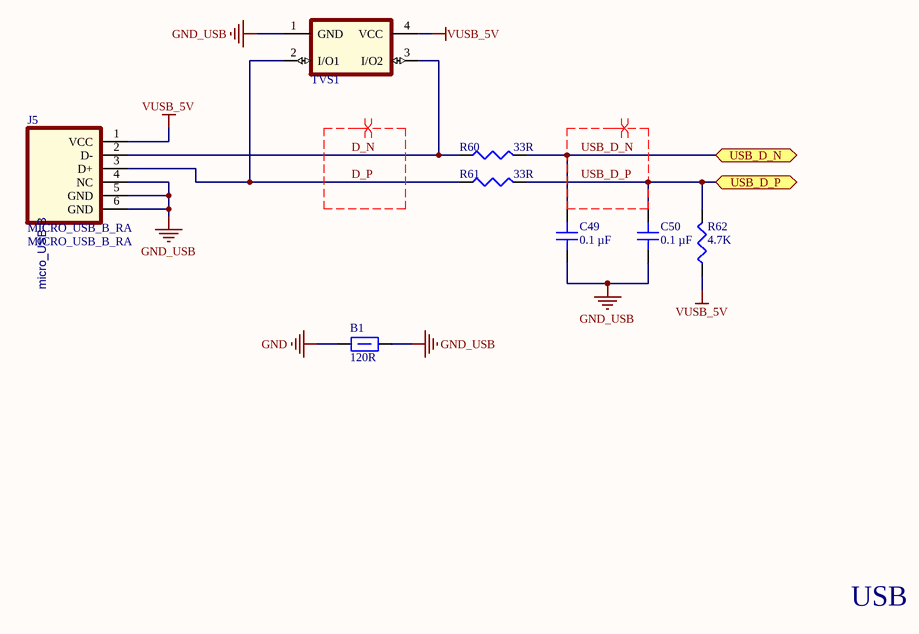
[diagram p9: USB.SchDoc]

### Parts
B1  value 120R  [F0603]  (hidden comment: BEAD FERRITE 120R 1LN SMD 0603)
C49  0.1 µF  [CAP 0603_1608]
C50  0.1 µF  [CAP 0603_1608]
J5  MICRO_USB_B_RA  [MICRO_USB_B]
R60  33R  [R 0603(1608)]
R61  33R  [R 0603(1608)]
R62  4.7K  [R 0603(1608)]
TVS1  TVS DIODE PRTR5V0U2X,215 5.5VWM 6V SOT143  [SOT143]  (value not drawn)

### Ports
USB_D_N (bidir), USB_D_P (bidir)

### Nets
GND: B1.1
GND_USB: B1.2 C49.1 C50.1 J5.4(NC) J5.5(GND) J5.6(GND) TVS1.1(GND)
VUSB_5V: J5.1(VCC) R62.2 TVS1.4(VCC)
D_N: J5.2(D-) R60.2 TVS1.3(I/O2)
D_P: J5.3(D+) R61.2 TVS1.2(I/O1)
USB_D_N: C49.2 R60.1 ; port USB_D_N
USB_D_P: C50.2 R61.1 R62.1 ; port USB_D_P

### Layout directives
differential pair; differential pair class 90ohm: D_N, D_P, USB_D_N, USB_D_P

### Notes on the sheet
- USB
- (in symbol MICRO_USB_B_RA) micro_USB-B

### Library data of the parts
B1 = BEAD FERRITE 120R 1LN SMD 0603: Manufacturer: MURATA; Manufacturer Part Name: BLM18PG121SN1D; Code: 3030007; Family: BEAD; Supplier: Digikey; Supplier No: 490-1037-2-ND; Package Reference: F1206
C49 C50 = 0603BB104K500NGT: CAP CER 0.1UF 50V X7R 0603; Part Number: 0603BB104K500NGT; Value: 0.1 µF
J5 = MICRO_USB_B_RA: CONN MICRO B USB 2.0 RECEPTACLE 5POS SMD RA; Manufacturer: AMPHENOL; Manufacturer Part Name: 10118194-0001LF; Code: 3050016; Family: CONN; Supplier: Digikey; Supplier No: 609-4618-2-ND; Value: MICRO_USB_B_RA
R60 R61 = Res3: Res Thick Film 0603 33 Ohm 1% 1/10W +/-100ppm/ßC Molded SMD Paper T/R; Manufacturer: Yageo; Manufacturer Part Number: RC0603FR-0733RL; Temperature Coefficient: 100ppm/°C; Voltage Rating (DC): 50V; Power Rating: 100mW; Voltage Rating: 75V; ComponentLink1URL: https://datasheet.ciiva.com/11819/0900766b80c66297-11819477.pdf?src-supplier=RSComponents; ComponentLink1Description: https://datasheet.ciiva.com/11819/0900766b80c66297-11819477.pdf?src-supplier=RSComponents; ComponentLink2URL: https://datasheet.ciiva.com/12666/pyu-rc0402-51-rohs-l-6-r-12666741.pdf?src-supplier=Mouser; ComponentLink2Description: https://datasheet.ciiva.com/12666/pyu-rc0402-51-rohs-l-6-r-12666741.pdf?src-supplier=Mouser; ComponentLink3URL: https://datasheet.ciiva.com/17063/pyu-rc0402-51-rohs-l-6-r-17063193.pdf?src-supplier=Future+Electronics; ComponentLink3Description: https://datasheet.ciiva.com/17063/pyu-rc0402-51-rohs-l-6-r-17063193.pdf?src-supplier=Future+Electronics; ComponentLink4URL: https://datasheet.ciiva.com/22747/1018594-22747513.pdf?src-supplier=Element14; ComponentLink4Description: https://datasheet.ciiva.com/22747/1018594-22747513.pdf?src-supplier=Element14; ComponentLink5URL: https://datasheet.ciiva.com/7849/1018594-7849869.pdf?src-supplier=Element14; ComponentLink5Description: https://datasheet.ciiva.com/7849/1018594-7849869.pdf?src-supplier=Element14; ComponentLink6URL: https://datasheet.ciiva.com/7983/1018594-7983502.pdf?src-supplier=Element14; ComponentLink6Description: https://datasheet.ciiva.com/7983/1018594-7983502.pdf?src-supplier=Element14; ComponentLink7URL: https://datasheet.ciiva.com/7849/1018594-7849871.pdf?src-supplier=Element14; ComponentLink7Description: https://datasheet.ciiva.com/7849/1018594-7849871.pdf?src-supplier=Element14; ComponentLink8URL: https://datasheet.ciiva.com/11808/0900766b80c66297-11808195.pdf?src-supplier=RSComponents; ComponentLink8Description: https://datasheet.ciiva.com/11808/0900766b80c66297-11808195.pdf?src-supplier=RSComponents; ComponentLink9URL: https://datasheet.ciiva.com/2452/pyu-rc0402-51-rohs-l-6-2452608.pdf?src-supplier=Digi-Key; ComponentLink9Description: https://datasheet.ciiva.com/2452/pyu-rc0402-51-rohs-l-6-2452608.pdf?src-supplier=Digi-Key; ComponentLink10URL: https://datasheet.ciiva.com/2452/pyu-r-int-thick-7-2452609.pdf?src-supplier=Digi-Key; ComponentLink10Description: https://datasheet.ciiva.com/2452/pyu-r-int-thick-7-2452609.pdf?src-supplier=Digi-Key; ComponentLink11URL: https://datasheet.ciiva.com/2452/pyu-r-int-thick-7-2452610.pdf?src-supplier=Digi-Key; ComponentLink11Description: https://datasheet.ciiva.com/2452/pyu-r-int-thick-7-2452610.pdf?src-supplier=Digi-Key; ComponentLink12URL: https://datasheet.ciiva.com/28386/pyu-rc0402-51-rohs-l-6-28386633.pdf?src-supplier=Avnet+Europe; ComponentLink12Description: https://datasheet.ciiva.com/28386/pyu-rc0402-51-rohs-l-6-28386633.pdf?src-supplier=Avnet+Europe; ComponentLink13URL: https://datasheet.ciiva.com/22747/1018594-22747515.pdf?src-supplier=Element14; ComponentLink13Description: https://datasheet.ciiva.com/22747/1018594-22747515.pdf?src-supplier=Element14; ComponentLink14URL: https://datasheet.ciiva.com/7983/1018594-7983535.pdf?src-supplier=Element14; ComponentLink14Description: https://datasheet.ciiva.com/7983/1018594-7983535.pdf?src-supplier=Element14; ComponentLink15URL: https://datasheet.ciiva.com/8896/pyu-rc0402-51-rohs-l-6-8896201.pdf?src-supplier=Avnet; ComponentLink15Description: https://datasheet.ciiva.com/8896/pyu-rc0402-51-rohs-l-6-8896201.pdf?src-supplier=Avnet; ComponentLink16URL: https://datasheet.ciiva.com/15189/getdatasheetpartid-326379-15189533.pdf?src-supplier=Verical; ComponentLink16Description: https://datasheet.ciiva.com/15189/getdatasheetpartid-326379-15189533.pdf?src-supplier=Verical; Supplier 1: Digi-Key; Supplier Part Number 1: 311-33.0HRCT-ND; RoHS: Yes; Category: Chip SMD Resistors; Stock 1: 1329282; Pricing 1: 1=0,10000, 10=0,02400, 100=0,00970, 1000=0,00436, 2500=0,00378 (USD); Case/Package: 0603; Number of Pins: 2; Case Code (Metric): 1608; Case Code (Imperial): 0603; Weight: 7.1E-05oz; Size Code: 0603; Min Operating Temperature: -55°C; Max Operating Temperature: 155°C; Resistance: 33R; Tolerance: 1%; Resistor Type: Thick Film; Packaging: Tape and Reel; Package Quantity: 1; Number of Terminations: 2; Termination: SMD/SMT; Max Power Dissipation: 100mW; Features: Moisture Resistant; Series: RC; Resistance Tolerance: 1%; Technology: THICK FILM; Construction: Rectangular; Length: 1.6mm; Width: 0.8mm; Height: 0.45mm; Depth: 0.8mm; Lead Pitch: 0.3mm; REACH SVHC: No SVHC; Lead Free: Lead Free; Military Standard: Not; RoHS Compliant: Yes; ComponentLink17URL: https://datasheet.ciiva.com/11808/0900766b80f96399-11808741.pdf?src-supplier=RSComponents; ComponentLink17Description: https://datasheet.ciiva.com/11808/0900766b80f96399-11808741.pdf?src-supplier=RSComponents; ComponentLink18URL: https://datasheet.ciiva.com/2453/pyu-r-int-thick-7-2453952.pdf?src-supplier=Digi-Key; ComponentLink18Description: https://datasheet.ciiva.com/2453/pyu-r-int-thick-7-2453952.pdf?src-supplier=Digi-Key; ComponentLink19URL: https://datasheet.ciiva.com/2453/pyu-r-int-thick-7-2453953.pdf?src-supplier=Digi-Key; ComponentLink19Description: https://datasheet.ciiva.com/2453/pyu-r-int-thick-7-2453953.pdf?src-supplier=Digi-Key; ComponentLink20URL: https://datasheet.ciiva.com/2453/pyu-r-int-thick-7-2453954.pdf?src-supplier=Digi-Key; ComponentLink20Description: https://datasheet.ciiva.com/2453/pyu-r-int-thick-7-2453954.pdf?src-supplier=Digi-Key; ComponentLink21URL: https://datasheet.ciiva.com/7660/38590-7660792.pdf?src-supplier=Element14; ComponentLink21Description: https://datasheet.ciiva.com/7660/38590-7660792.pdf?src-supplier=Element14; ComponentLink22URL: https://datasheet.ciiva.com/15189/getdatasheetpartid-326673-15189708.pdf?src-supplier=Verical; ComponentLink22Description: https://datasheet.ciiva.com/15189/getdatasheetpartid-326673-15189708.pdf?src-supplier=Verical; ComponentLink23URL: https://datasheet.ciiva.com/7746/443971-7746334.pdf?src-supplier=Element14; ComponentLink23Description: https://datasheet.ciiva.com/7746/443971-7746334.pdf?src-supplier=Element14; ComponentLink24URL: https://datasheet.ciiva.com/7746/443971-7746335.pdf?src-supplier=Element14; ComponentLink24Description: https://datasheet.ciiva.com/7746/443971-7746335.pdf?src-supplier=Element14; ComponentLink25URL: https://datasheet.ciiva.com/46395/443971-46395007.pdf?src-supplier=Element14; ComponentLink25Description: https://datasheet.ciiva.com/46395/443971-46395007.pdf?src-supplier=Element14
R62 = Res3: Res Thick Film 0603 4.7K Ohm 5% 0.1W(1/10W) ±100ppm/C Molded SMD Paper T/R; Manufacturer: Yageo; Manufacturer Part Number: RC0603JR-074K7L; Resistance: 4.7kR; Temperature Coefficient: 100ppm/°C; Voltage Rating (DC): 50V; Power Rating: 100mW; ComponentLink1URL: https://datasheet.ciiva.com/11819/0900766b80c66297-11819477.pdf?src-supplier=RSComponents; ComponentLink1Description: https://datasheet.ciiva.com/11819/0900766b80c66297-11819477.pdf?src-supplier=RSComponents; ComponentLink2URL: https://datasheet.ciiva.com/12666/pyu-rc0402-51-rohs-l-6-r-12666741.pdf?src-supplier=Mouser; ComponentLink2Description: https://datasheet.ciiva.com/12666/pyu-rc0402-51-rohs-l-6-r-12666741.pdf?src-supplier=Mouser; ComponentLink3URL: https://datasheet.ciiva.com/17063/pyu-rc0402-51-rohs-l-6-r-17063193.pdf?src-supplier=Future+Electronics; ComponentLink3Description: https://datasheet.ciiva.com/17063/pyu-rc0402-51-rohs-l-6-r-17063193.pdf?src-supplier=Future+Electronics; ComponentLink4URL: https://datasheet.ciiva.com/22747/1018594-22747513.pdf?src-supplier=Element14; ComponentLink4Description: https://datasheet.ciiva.com/22747/1018594-22747513.pdf?src-supplier=Element14; ComponentLink5URL: https://datasheet.ciiva.com/7849/1018594-7849869.pdf?src-supplier=Element14; ComponentLink5Description: https://datasheet.ciiva.com/7849/1018594-7849869.pdf?src-supplier=Element14; ComponentLink6URL: https://datasheet.ciiva.com/7983/1018594-7983502.pdf?src-supplier=Element14; ComponentLink6Description: https://datasheet.ciiva.com/7983/1018594-7983502.pdf?src-supplier=Element14; ComponentLink7URL: https://datasheet.ciiva.com/7849/1018594-7849871.pdf?src-supplier=Element14; ComponentLink7Description: https://datasheet.ciiva.com/7849/1018594-7849871.pdf?src-supplier=Element14; ComponentLink8URL: https://datasheet.ciiva.com/11808/0900766b80c66297-11808195.pdf?src-supplier=RSComponents; ComponentLink8Description: https://datasheet.ciiva.com/11808/0900766b80c66297-11808195.pdf?src-supplier=RSComponents; ComponentLink9URL: https://datasheet.ciiva.com/2452/pyu-rc0402-51-rohs-l-6-2452608.pdf?src-supplier=Digi-Key; ComponentLink9Description: https://datasheet.ciiva.com/2452/pyu-rc0402-51-rohs-l-6-2452608.pdf?src-supplier=Digi-Key; ComponentLink10URL: https://datasheet.ciiva.com/2452/pyu-r-int-thick-7-2452609.pdf?src-supplier=Digi-Key; ComponentLink10Description: https://datasheet.ciiva.com/2452/pyu-r-int-thick-7-2452609.pdf?src-supplier=Digi-Key; ComponentLink11URL: https://datasheet.ciiva.com/2452/pyu-r-int-thick-7-2452610.pdf?src-supplier=Digi-Key; ComponentLink11Description: https://datasheet.ciiva.com/2452/pyu-r-int-thick-7-2452610.pdf?src-supplier=Digi-Key; ComponentLink12URL: https://datasheet.ciiva.com/28386/pyu-rc0402-51-rohs-l-6-28386633.pdf?src-supplier=Avnet+Europe; ComponentLink12Description: https://datasheet.ciiva.com/28386/pyu-rc0402-51-rohs-l-6-28386633.pdf?src-supplier=Avnet+Europe; ComponentLink13URL: https://datasheet.ciiva.com/22747/1018594-22747515.pdf?src-supplier=Element14; ComponentLink13Description: https://datasheet.ciiva.com/22747/1018594-22747515.pdf?src-supplier=Element14; ComponentLink14URL: https://datasheet.ciiva.com/7983/1018594-7983535.pdf?src-supplier=Element14; ComponentLink14Description: https://datasheet.ciiva.com/7983/1018594-7983535.pdf?src-supplier=Element14; ComponentLink15URL: https://datasheet.ciiva.com/8896/pyu-rc0402-51-rohs-l-6-8896201.pdf?src-supplier=Avnet; ComponentLink15Description: https://datasheet.ciiva.com/8896/pyu-rc0402-51-rohs-l-6-8896201.pdf?src-supplier=Avnet; ComponentLink16URL: https://datasheet.ciiva.com/15189/getdatasheetpartid-326379-15189533.pdf?src-supplier=Verical; ComponentLink16Description: https://datasheet.ciiva.com/15189/getdatasheetpartid-326379-15189533.pdf?src-supplier=Verical; ComponentLink17URL: https://datasheet.ciiva.com/11808/0900766b80f96399-11808741.pdf?src-supplier=RSComponents; ComponentLink17Description: https://datasheet.ciiva.com/11808/0900766b80f96399-11808741.pdf?src-supplier=RSComponents; ComponentLink18URL: https://datasheet.ciiva.com/2453/pyu-r-int-thick-7-2453952.pdf?src-supplier=Digi-Key; ComponentLink18Description: https://datasheet.ciiva.com/2453/pyu-r-int-thick-7-2453952.pdf?src-supplier=Digi-Key; ComponentLink19URL: https://datasheet.ciiva.com/2453/pyu-r-int-thick-7-2453953.pdf?src-supplier=Digi-Key; ComponentLink19Description: https://datasheet.ciiva.com/2453/pyu-r-int-thick-7-2453953.pdf?src-supplier=Digi-Key; ComponentLink20URL: https://datasheet.ciiva.com/2453/pyu-r-int-thick-7-2453954.pdf?src-supplier=Digi-Key; ComponentLink20Description: https://datasheet.ciiva.com/2453/pyu-r-int-thick-7-2453954.pdf?src-supplier=Digi-Key; ComponentLink21URL: https://datasheet.ciiva.com/7660/38590-7660792.pdf?src-supplier=Element14; ComponentLink21Description: https://datasheet.ciiva.com/7660/38590-7660792.pdf?src-supplier=Element14; ComponentLink22URL: https://datasheet.ciiva.com/15189/getdatasheetpartid-326673-15189708.pdf?src-supplier=Verical; ComponentLink22Description: https://datasheet.ciiva.com/15189/getdatasheetpartid-326673-15189708.pdf?src-supplier=Verical; ComponentLink23URL: https://datasheet.ciiva.com/7746/443971-7746334.pdf?src-supplier=Element14; ComponentLink23Description: https://datasheet.ciiva.com/7746/443971-7746334.pdf?src-supplier=Element14; ComponentLink24URL: https://datasheet.ciiva.com/7746/443971-7746335.pdf?src-supplier=Element14; ComponentLink24Description: https://datasheet.ciiva.com/7746/443971-7746335.pdf?src-supplier=Element14; ComponentLink25URL: https://datasheet.ciiva.com/46395/443971-46395007.pdf?src-supplier=Element14; ComponentLink25Description: https://datasheet.ciiva.com/46395/443971-46395007.pdf?src-supplier=Element14; ComponentLink26URL: https://datasheet.ciiva.com/15189/getdatasheetpartid-422754-15189760.pdf?src-supplier=Verical; ComponentLink26Description: https://datasheet.ciiva.com/15189/getdatasheetpartid-422754-15189760.pdf?src-supplier=Verical; ComponentLink27URL: https://datasheet.ciiva.com/22747/443971-22747528.pdf?src-supplier=Element14; ComponentLink27Description: https://datasheet.ciiva.com/22747/443971-22747528.pdf?src-supplier=Element14; ComponentLink28URL: https://datasheet.ciiva.com/7660/38590-7660794.pdf?src-supplier=Element14; ComponentLink28Description: https://datasheet.ciiva.com/7660/38590-7660794.pdf?src-supplier=Element14; ComponentLink29URL: https://datasheet.ciiva.com/7746/1868787-7746365.pdf?src-supplier=Element14; ComponentLink29Description: https://datasheet.ciiva.com/7746/1868787-7746365.pdf?src-supplier=Element14; ComponentLink30URL: https://datasheet.ciiva.com/46440/1868787-46440909.pdf?src-supplier=Element14; ComponentLink30Description: https://datasheet.ciiva.com/46440/1868787-46440909.pdf?src-supplier=Element14; ComponentLink31URL: https://datasheet.ciiva.com/7746/1738695-7746366.pdf?src-supplier=Element14; ComponentLink31Description: https://datasheet.ciiva.com/7746/1738695-7746366.pdf?src-supplier=Element14; Supplier 1: Digi-Key; Supplier Part Number 1: 311-4.7KGRCT-ND; RoHS: Yes; Category: Chip SMD Resistors; Stock 1: 1931744; Pricing 1: 1=0,10000, 10=0,02000, 100=0,00800, 1000=0,00360, 2500=0,00312 (USD); Case/Package: 0603; Number of Pins: 2; Case Code (Imperial): 0603; Case Code (Metric): 1608; Size Code: 0603; Min Operating Temperature: -55°C; Max Operating Temperature: 155°C; Resistor Type: Thick Film; Tolerance: 5%; Packaging: Tape and Reel; Voltage Rating: 50V; Termination: SMD/SMT; Features: Moisture Resistant; Max Power Dissipation: 100mW; Number of Terminations: 2; Series: RC; Resistance Tolerance: 5%; Construction: Rectangular; Length: 1.6mm; Width: 0.8mm; Depth: 0.8mm; REACH SVHC: No SVHC; Lead Free: Lead Free; RoHS Compliant: Yes; Military Standard: Not; ComponentLink32URL: https://datasheet.ciiva.com/46412/443971-46412858.pdf?src-supplier=Element14; ComponentLink32Description: https://datasheet.ciiva.com/46412/443971-46412858.pdf?src-supplier=Element14
TVS1 = TVS DIODE PRTR5V0U2X,215 5.5VWM 6V SOT143: Manufacturer: NXP SEMI; Code: 3040037; Family: DIODE; Manufacturer Part Name: PRTR5V0U2X,215; Package Reference: SOT143; Supplier: Digikey; Supplier No: 568-4140-1-ND; Value: PRTR5V0U2X

## Sheet INPUT_PROTECTION.SchDoc
size A4; SheetNumber: 10; SheetTotal: 13
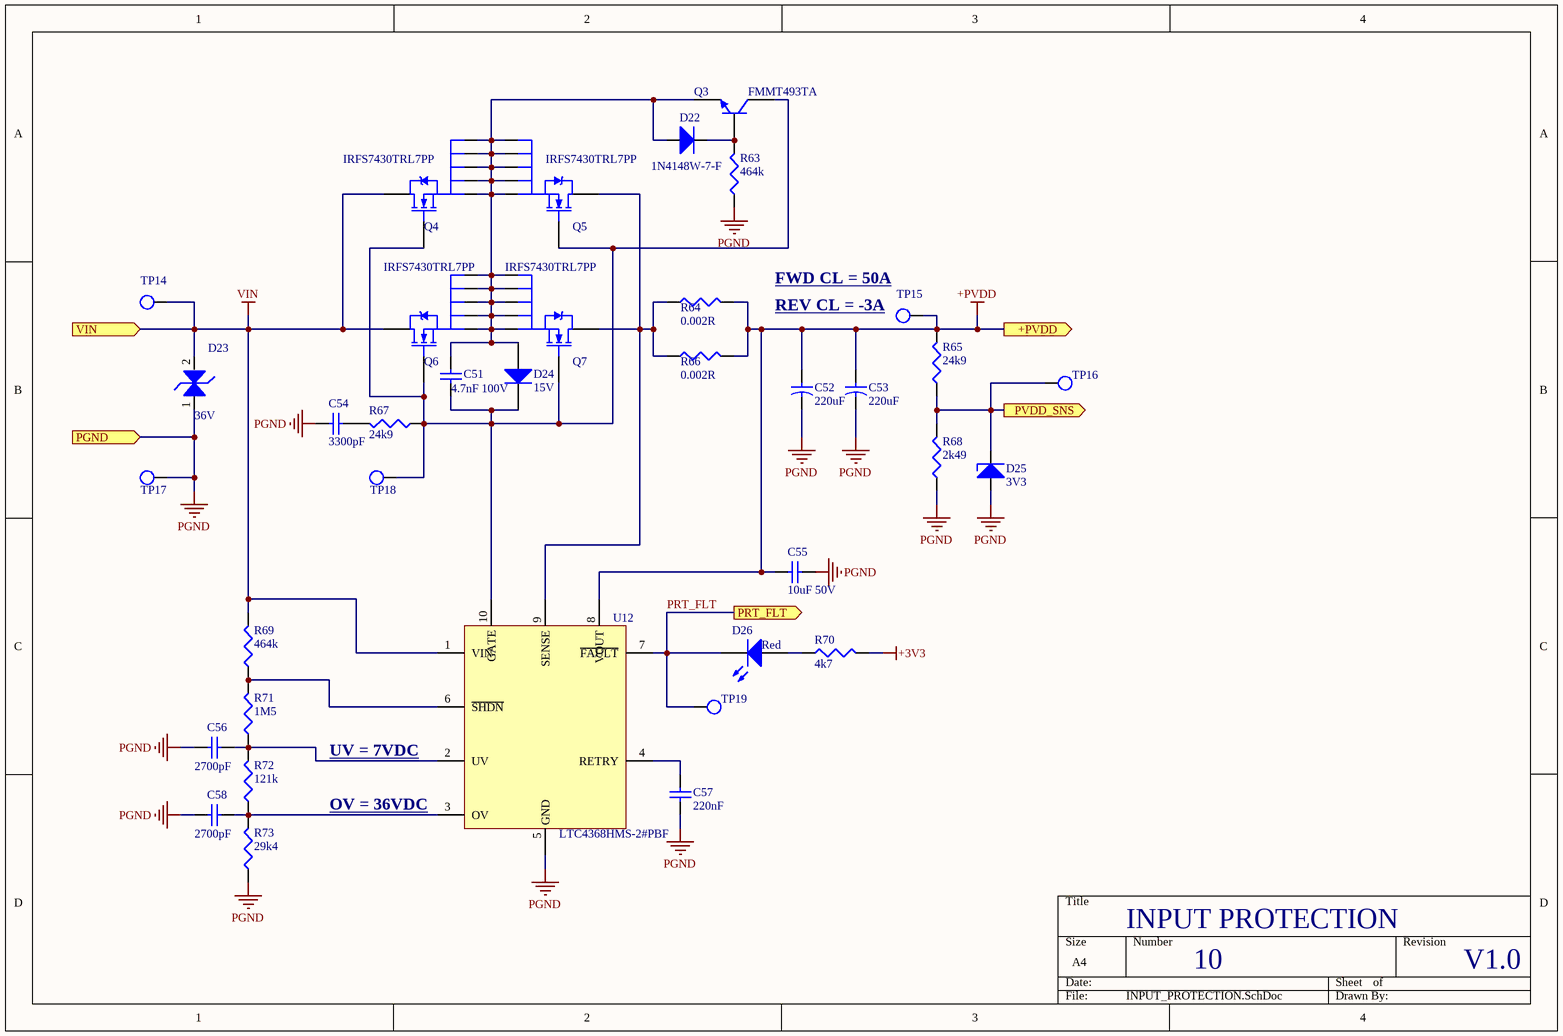
[diagram p10: INPUT_PROTECTION.SchDoc]

### Parts
C51  4.7nF 100V  [CAP1206]
C52  220uF  [CAP_RADIAL_SMD_10x10]
C53  220uF  [CAP_RADIAL_SMD_10x10]
C54  3300pF  [CAP0805]
C55  10uF 50V  [CAP1206]
C56  2700pF  [CAP0603]
C57  220nF  [CAP0603]
C58  2700pF  [CAP0603]
D22  P/N: 1N4148W-7-F  [SOD123_1N4148W-7-F]  (hidden comment: 100V 300mA)
D23  36V  [DO214AA]
D24  15V  [SOD128_PMEG10030ELPX]
D25  3V3  [SOD323]
D26  Red  [LED0603]
Q3  P/N: FMMT493TA  [SOT23_FMMT493TA]  (hidden comment: 100V 1A)
Q4  P/N: IRFS7430TRL7PP  [TO263-7_INFINEON]  (hidden comment: NMOS)
Q5  P/N: IRFS7430TRL7PP  [TO263-7_INFINEON]  (hidden comment: NMOS)
Q6  P/N: IRFS7430TRL7PP  [TO263-7_INFINEON]  (hidden comment: NMOS)
Q7  P/N: IRFS7430TRL7PP  [TO263-7_INFINEON]  (hidden comment: NMOS)
R63  464k  [RES0603]
R64  0.002R  [RES2512_WSLF_SERIES]
R65  24k9  [RES0603]
R66  0.002R  [RES2512_WSLF_SERIES]
R67  24k9  [RES0603]
R68  2k49  [RES0603]
R69  464k  [RES0603]
R70  4k7  [RES0603]
R71  1M5  [RES0603]
R72  121k  [RES0603]
R73  29k4  [RES0603]
TP14  TEST_POINT  [TEST_POINT_TH]  (value not drawn)  (no BOM)
TP15  TEST_POINT  [TEST_POINT_TH]  (value not drawn)  (no BOM)
TP16  TEST_POINT  [TEST_POINT_TH]  (value not drawn)  (no BOM)
TP17  TEST_POINT  [TEST_POINT_TH]  (value not drawn)  (no BOM)
TP18  TEST_POINT  [TEST_POINT_TH]  (value not drawn)  (no BOM)
TP19  TEST_POINT  [TEST_POINT_TH]  (value not drawn)  (no BOM)
U12  ADJ  [MSOP10]  (value not drawn)

### Ports
+PVDD (out), PGND (in), PRT_FLT (out), PVDD_SNS (out), VIN (in)

### Nets
+3V3: R70.2
+PVDD: C52.1 C53.1 C55.2 R64.2 R65.2 R66.2 TP15.1 U12.8(VOUT) ; port +PVDD
PGND: C52.2 C53.2 C54.1 C55.1 C56.1 C57.1 C58.1 D23.1 D25.2(A) R63.1 R68.1 R73.1 TP17.1 U12.5(GND) ; port PGND
VIN: D23.2 Q4.8(D) Q6.8(D) R69.2 TP14.1 U12.1(VIN) ; port VIN
PRT_FLT: D26.2(K) TP19.1 U12.7(~{FAULT}) ; port PRT_FLT
PVDD_SNS: D25.1(K) R65.1 R68.2 TP16.1 ; port PVDD_SNS
NetC51_1: C51.1 D24.2(K) Q3.3(C) Q4.1(G) Q5.1(G) Q6.1(G) Q7.1(G) R67.1 TP18.1 U12.10(GATE)
NetC51_2: C51.2 D22.1(A) D24.1(A) Q3.1(E) Q4.2(S) Q4.3(S) Q4.5(S) Q4.6(S) Q4.7(S) Q5.2(S) Q5.3(S) Q5.5(S) Q5.6(S) Q5.7(S) Q6.2(S) Q6.3(S) Q6.5(S) Q6.6(S) Q6.7(S) Q7.2(S) Q7.3(S) Q7.5(S) Q7.6(S) Q7.7(S)
NetC54_2: C54.2 R67.2
NetC56_2: C56.2 R71.1 R72.2 U12.2(UV)
NetC57_2: C57.2 U12.4(RETRY)
NetC58_2: C58.2 R72.1 R73.2 U12.3(OV)
NetD22_2: D22.2(K) Q3.2(B) R63.2
NetD26_1: D26.1(A) R70.1
NetQ5_8: Q5.8(D) Q7.8(D) R64.1 R66.1 U12.9(SENSE)
NetR69_1: R69.1 R71.2 U12.6(~{SHDN})

### Notes on the sheet
- FWD CL = 50A
- (near TP15) REV CL = -3A
- UV = 7VDC
- (near U12) OV = 36VDC
- INPUT PROTECTION

### Library data of the parts
C51 = CAP1206_4.7nF_100V: CAP CER 4700PF 100V X7R 1206; P/N: CC1206KRX7R0BB472; Order Code: DIGI : 311-4480-1-ND; Value: 4.7nF 100V
C52 C53 = CAP_RADIAL_EEE-FK1H221GP: CAP ALUM 220UF 20% 50V SMD; Value: 220uF 50V; Order Code: DIGI : PCE4324CT-ND; P/N: EEE-FK1H221GP
C54 = CAP0805_3300pF: CAP CER 3300PF 100V X7R 0805; P/N: CGA4F2X7R2A332M085AA; Order Code: DIGI : 445-12724-1-ND; Value: 3300pF
C55 = CAP1206_10uF: CAP CER 10UF 50V X7R 1206; P/N: CL31B106KBHNNNE; Order Code: DIGI : 1276-6767-1-ND; Value: 10uF 50V
C56 C58 = CAP0603_2700pF: CAP CER 1200PF 50V X7R 0603; P/N: CL10B272KB8NNNC; Value: 2700pF 50V; Order Code: DIGI : 1276-2022-1-ND
C57 = CAP0603_220n: CAP CER 0.22UF 50V X7R 0603; P/N: CGA3E3X7R1H224K080AB; Value: 220nF 50V; Order Code: DIGI : 445-6926-1-ND
D22 = DIODE_1N4148W-7-F: as D6 on sheet F_BRIDGE; Value: 100V 300mA
D23 = SMBJ36CA-TR_TVS_BI_DIR: as D16 on sheet HS_SW; P/N: SMBJ36CA-TR; Value: 36V
D24 = ZNR_DZ2415000L: DIODE ZENER 15V 2W TMINIP2; Value: 15V 2W; Order Code: DIGI : DZ2415000LCT-ND; P/N: DZ2415000L
D25 = ZENER_3V3_MM3Z3V3T1G: as D7 on sheet F_BRIDGE; P/N: MM3Z3V3T1G; Value: 3V3
D26 = LED0603_RED: LED RED CLEAR 0603 SMD; P/N: 150060RS75000; Order Code: DIGI : 732-4978-1-ND; Value: Red
Q3 = FMMT493TA_NPN: TRANS NPN 100V 1A SOT23-3; Order Code: DIGI : FMMT493CT-ND; Value: 100V 1A
Q4-Q7 = IRFS7430TRL7PP_NMOS: MOSFET N-CH 40V 240A D2PAK; Order Code: DIGI : IRFS7430TRL7PPCT-ND; Value: 40V 240A
R63 R69 = RES0603_464k: RES 464K OHM 1% 1/10W 0603; Order Code: DIGI : RMCF0603FT464KCT-ND; P/N: RMCF0603FT464K; Value: 464k
R64 R66 = RES2512_2mR: RES 0.002 OHM 1% 5W 2512; P/N: CSS2H-2512K-2L00F; Order Code: DIGI : CSS2H-2512K-2L00FCT-ND; Value: 0.002R
R65 R67 = RES0603_24k9: as R50 on sheet HS_SW; Value: 24k9
R68 = RES0603_2k49: as R28 on sheet F_BRIDGE; Value: 2k49
R70 = RES0603_4k7: RES SMD 4.7K OHM 1% 1/10W 0603; Order Code: DIGI : 311-4.70KHRCT-ND; P/N: RC0603FR-074K7L; Value: 4k7
R71 = RES0603_1M5: RES 1.5M OHM 1% 1/10W 0603; Order Code: DIGI : RMCF0603FT1M50CT-ND; P/N: RMCF0603FT1M50; Value: 1M5
R72 = RES0603_121k: RES 121K OHM 1% 1/10W 0603; Order Code: DIGI : RMCF0603FT121KCT-ND; P/N: RMCF0603FT121K; Value: 121k
R73 = RES0603_29k4: RES SMD 29.4K OHM 1% 1/10W 0603; Order Code: DIGI : 311-29.4KHRCT-ND; P/N: RC0603FR-0729K4L; ART Code: ART0022327; Value: 29k4
U12 = LTC4368HMS-2#PBF: IC SURGE SUPPRESSION ADJ 10MSOP; Order Code: DIGI : LTC4368HMS-2#PBF-ND; Value: ADJ; P/N: LTC4368HMS-2#PBF

## Sheet Voltage_conversion.SchDoc
size A4; SheetNumber: 3; SheetTotal: 13
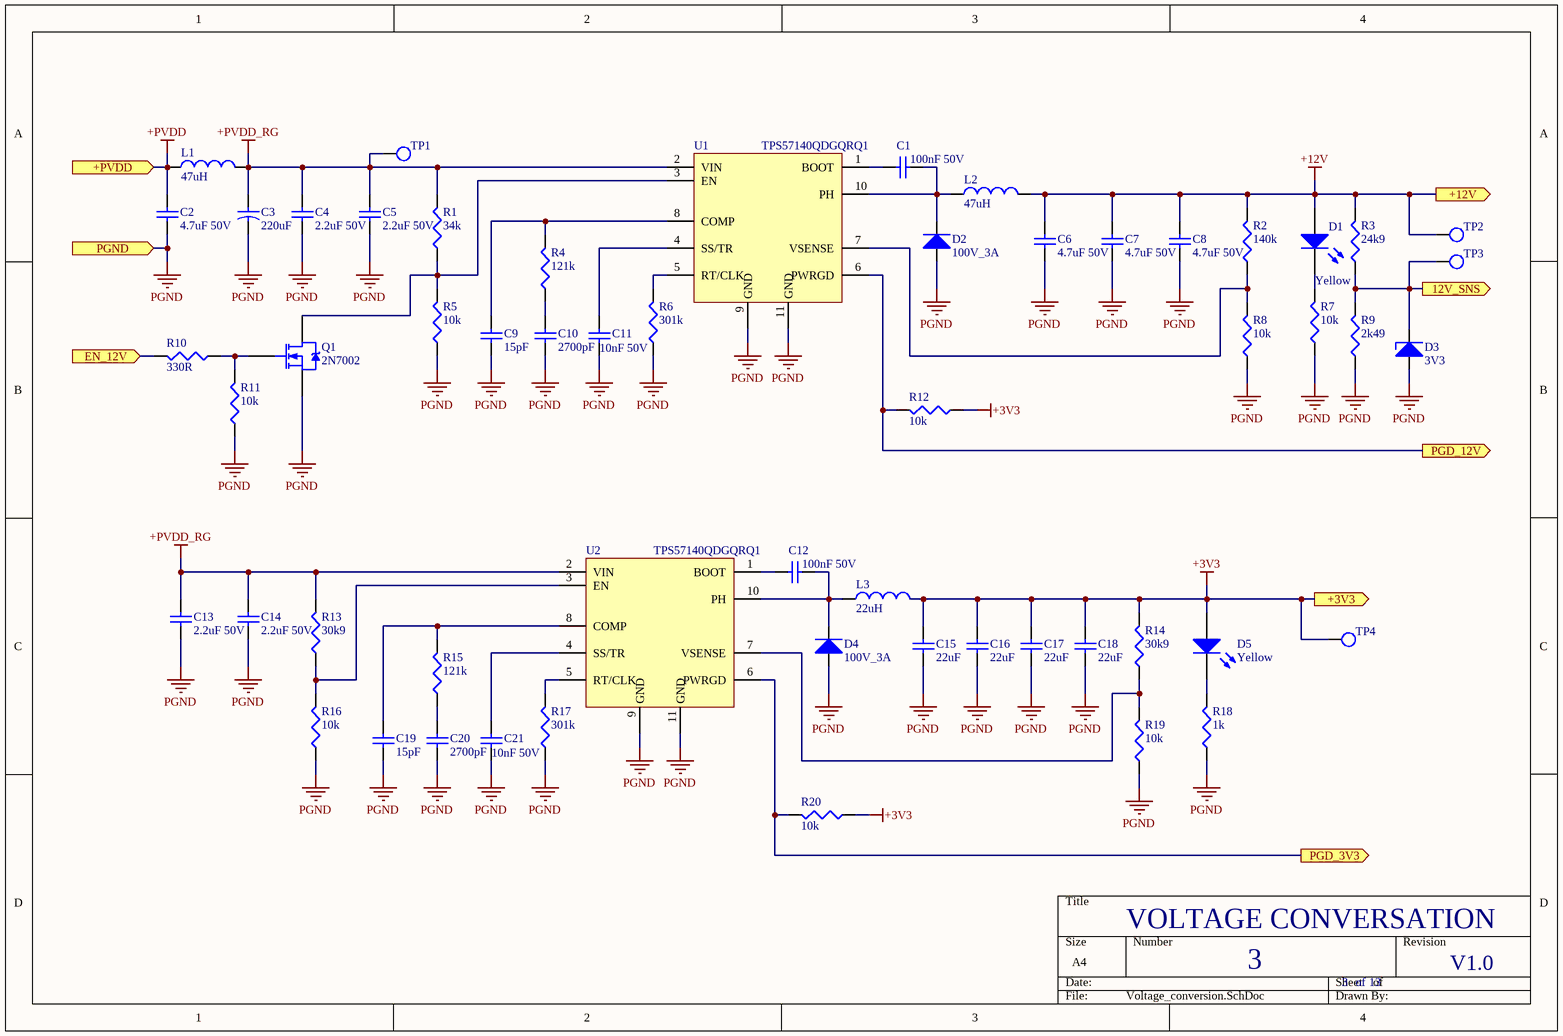
[diagram p11: Voltage_conversion.SchDoc]

### Parts
C1  100nF 50V  [CAP0603]
C2  4.7uF 50V  [CAP1206]
C3  220uF  [CAP_RADIAL_SMD_10x10]
C4  2.2uF 50V  [CAP1206]
C5  2.2uF 50V  [CAP1206]
C6  4.7uF 50V  [CAP1206]
C7  4.7uF 50V  [CAP1206]
C8  4.7uF 50V  [CAP1206]
C9  15pF  [CAP0603]
C10  2700pF  [CAP0603]
C11  10nF 50V  [CAP0603]
C12  100nF 50V  [CAP0603]
C13  2.2uF 50V  [CAP1206]
C14  2.2uF 50V  [CAP1206]
C15  22uF  [CAP1206]
C16  22uF  [CAP1206]
C17  22uF  [CAP1206]
C18  22uF  [CAP1206]
C19  15pF  [CAP0603]
C20  2700pF  [CAP0603]
C21  10nF 50V  [CAP0603]
D1  Yellow  [LED0603]
D2  100V_3A  [DO-221A]
D3  3V3  [SOD323]
D4  100V_3A  [DO-221A]
D5  Yellow  [LED0603]
L1  47uH  [IND_SRR1208]
L2  47uH  [IND_SRR1208]
L3  22uH  [IND_VLS]
Q1  2N7002  [SOT23_2N7002]
R1  34k  [RES0603]
R2  140k  [RES0603]
R3  24k9  [RES0603]
R4  121k  [RES0603]
R5  10k  [RES0603]
R6  301k  [RES0603]
R7  10k  [RES0603]
R8  10k  [RES0603]
R9  2k49  [RES0603]
R10  330R  [RES0603]
R11  10k  [RES0603]
R12  10k  [RES0603]
R13  30k9  [RES0603]
R14  30k9  [RES0603]
R15  121k  [RES0603]
R16  10k  [RES0603]
R17  301k  [RES0603]
R18  1k  [RES0603]
R19  10k  [RES0603]
R20  10k  [RES0603]
TP1  TEST_POINT  [TEST_POINT_TH]  (value not drawn)  (no BOM)
TP2  TEST_POINT  [TEST_POINT_TH]  (value not drawn)  (no BOM)
TP3  TEST_POINT  [TEST_POINT_TH]  (value not drawn)  (no BOM)
TP4  TEST_POINT  [TEST_POINT_TH]  (value not drawn)  (no BOM)
U1  P/N: TPS57140QDGQRQ1  [MSOP_EP]  (hidden comment: 1.5A)
U2  P/N: TPS57140QDGQRQ1  [MSOP_EP]  (hidden comment: 1.5A)

### Ports
12V_SNS (out), +3V3 (out), +12V (out), +PVDD (in), EN_12V (in), PGD_3V3 (out), PGD_12V (out), PGND (in)

### Nets
+3V3: C15.2 C16.2 C17.2 C18.2 D5.1(A) L3.2 R12.1 R14.2 R20.1 TP4.1 ; port +3V3
+12V: C6.2 C7.2 C8.2 D1.1(A) L2.2 R2.2 R3.2 TP2.1 ; port +12V  [project net +12]
+PVDD: C2.2 L1.1 ; port +PVDD
+PVDD_RG: C3.1 C4.2 C5.2 C13.2 C14.2 L1.2 R1.2 R13.2 TP1.1 U1.2(VIN) U2.2(VIN)
PGND: C2.1 C3.2 C4.1 C5.1 C6.1 C7.1 C8.1 C9.1 C10.1 C11.1 C13.1 C14.1 C15.1 C16.1 C17.1 C18.1 C19.1 C20.1 C21.1 D2.2(A) D3.2(A) D4.2(A) Q1.2(S) R5.1 R6.1 R7.1 R8.1 R9.1 R11.1 R16.1 R17.1 R18.1 R19.1 U1.9(GND) U1.11(GND) U2.9(GND) U2.11(GND) ; port PGND
12V_SNS: D3.1(K) R3.1 R9.2 TP3.1 ; port 12V_SNS
EN_12V: R10.2 ; port EN_12V
PDG_12V: R12.2 U1.6(PWRGD) ; port PGD_12V
PGD_3V3: R20.2 U2.6(PWRGD) ; port PGD_3V3
NetC1_1: C1.1 D2.1(K) L2.1 U1.10(PH)
NetC1_2: C1.2 U1.1(BOOT)
NetC9_2: C9.2 R4.2 U1.8(COMP)
NetC10_2: C10.2 R4.1
NetC11_2: C11.2 U1.4(SS/TR)
NetC12_1: C12.1 D4.1(K) L3.1 U2.10(PH)
NetC12_2: C12.2 U2.1(BOOT)
NetC19_2: C19.2 R15.2 U2.8(COMP)
NetC20_2: C20.2 R15.1
NetC21_2: C21.2 U2.4(SS/TR)
NetD1_2: D1.2(K) R7.2
NetD5_2: D5.2(K) R18.2
NetQ1_1: Q1.1(G) R10.1 R11.2
NetQ1_3: Q1.3(D) R1.1 R5.2 U1.3(EN)
NetR2_1: R2.1 R8.2 U1.7(VSENSE)
NetR6_2: R6.2 U1.5(RT/CLK)
NetR13_1: R13.1 R16.2 U2.3(EN)
NetR14_1: R14.1 R19.2 U2.7(VSENSE)
NetR17_2: R17.2 U2.5(RT/CLK)

### Notes on the sheet
- VOLTAGE CONVERSATION
- of

### Library data of the parts
C1 C12 = CAP0603_100nF: as C29 on sheet F_BRIDGE; Value: 100nF 50V
C2 C6-C8 = CAP1206_4.7uF: as C40 on sheet HS_SW; Value: 4.7uF 50V
C3 = CAP_RADIAL_EEE-FK1H221GP: as C52 on sheet INPUT_PROTECTION; P/N: EEE-FK1H221GP
C4 C5 C13 C14 = CAP1206_2.2uF_50V: CAP CER 2.2UF 50V X7R 1206; P/N: C1206X225K5RACAUTO; Order Code: DIGI : 399-7041-1-ND; Value: 2.2uF 50V
C9 C19 = CAP0603_15pF: CAP CER 15PF 50V C0G/NP0 0603; P/N: 06035A150JAT4A; Order Code: DIGI : 478-10677-1-ND; Value: 15pF 50V
C10 C20 = CAP0603_2700pF: as C56 on sheet INPUT_PROTECTION
C11 C21 = CAP0603_10nF: CAP CER 10nF 50V X7R 0603; P/N: C0603C103K5RACTU; Order Code: DIGI : 399-1091-1-ND; Value: 10nF 50V
C15-C18 = CAP1206_22uF_16V: CAP CER 22UF 16V X6S 1206; P/N: GRT31CC81C226KE01L; Order Code: DIGI : 490-12409-1-ND; Value: 22uF
D1 D5 = LED0603_YELLOW: LED YELLOW CLEAR 0603 SMD; P/N: 150060YS75000; Order Code: DIGI : 732-4981-1-ND; Value: Yellow
D2 D4 = FRED_VS-3EYH01-M3/H_100V_3A: as D17 on sheet HS_SW; P/N: VS-3EYH01-M3/H
D3 = ZENER_3V3_MM3Z3V3T1G: as D7 on sheet F_BRIDGE; P/N: MM3Z3V3T1G; Value: 3V3
L1 L2 = IND_SRR1280-470M: FIXED IND 47UH 2.9A 80 MOHM SMD; Order Code: DIGI : SRR1280-470MCT-ND; P/N: SRR1280-470M; Value: 47uH
L3 = IND_VLS6045EX-220M-H: FIXED IND 22UH 1.9A 105MOHM SMD; Order Code: DIGI : 445-180935-1-ND; P/N: VLS6045EX-220M-H; Value: 22uH
Q1 = 2N7002P,215_NMOS_60V: MOSFET N-CH 60V 0.36A SOT-23; Value: 60V 360mA; Order Code: DIGI : 1727-4692-1-ND; P/N: 2N7002P,215
R1 = RES0603_34k: RES SMD 34K OHM 1% 1/10W 0603; Order Code: DIGI : P34.0KHCT-ND; P/N: ERJ-3EKF3402V; ART Code: ART0022192; Value: 34k
R2 = RES0603_140k: RES 1470 OHM 1% 1/10W 0603; Order Code: DIGI : RMCF0603FT140KCT-ND; P/N: RMCF0603FT140K; Value: 140k
R3 = RES0603_24k9: as R50 on sheet HS_SW; Value: 24k9
R4 R15 = RES0603_121k: as R72 on sheet INPUT_PROTECTION; Value: 121k
R5 R7 R8 R11 R12 R16 R19 R20 = RES0603_10k: as R25 on sheet F_BRIDGE; Value: 10k
R6 R17 = RES0603_301k: RES SMD 301K OHM 1% 1/10W 0603; Order Code: DIGI : 311-301KHRCT-ND; P/N: RC0603FR-07301KL; ART Code: ART0023385; Value: 301k
R9 = RES0603_2k49: as R28 on sheet F_BRIDGE; Value: 2k49
R10 = RES0603_330R: as R24 on sheet F_BRIDGE; Value: 330R
R13 R14 = RES0603_30k9: RES SMD 30K9 OHM 1% 1/10W 0603; Order Code: DIGI : RMCF0603FT30K9CT-ND; P/N: RMCF0603FT30K9; Value: 30k9
R18 = RES0603_1k: as R29 on sheet F_BRIDGE; Value: 1k
U1 U2 = REG_SMPS_TPS57140QDGQRQ1: IC REG BUCK ADJ 1.5A 10MSOP; Order Code: DIGI : 296-28157-1-ND; Value: 1.5A